# Altium project XC7Z010_Test_Bd_(Rev.A).PrjPcb
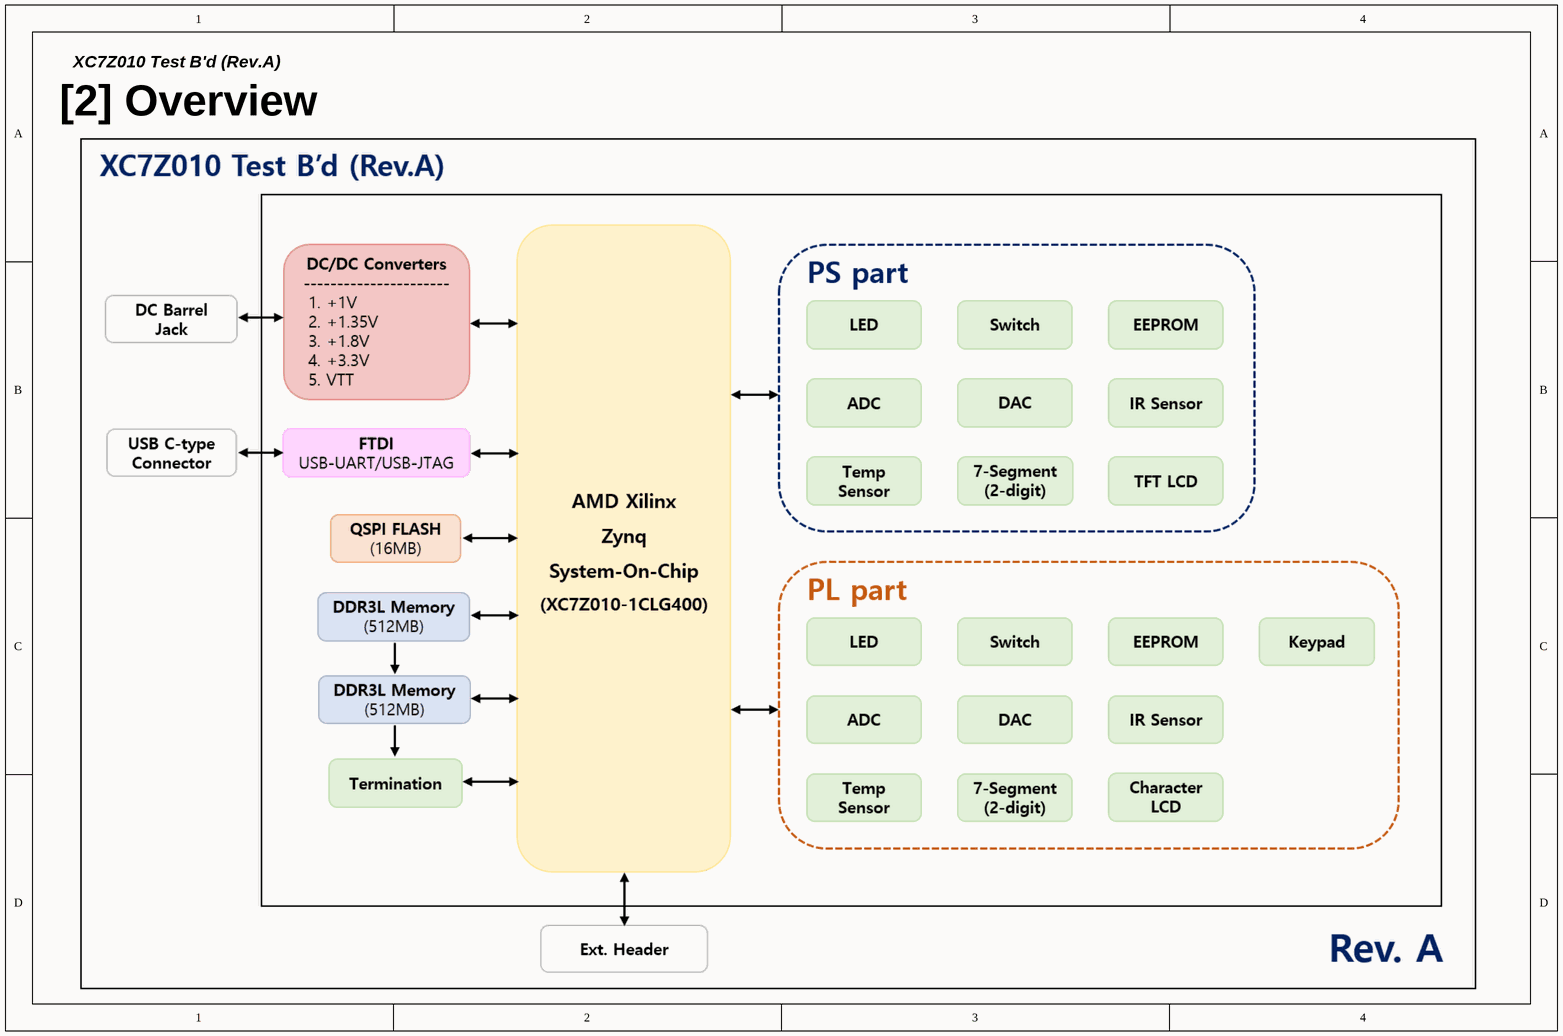
[diagram p0: 01_Overview.SchDoc]
10 sheets, 237 parts. Net scope: global (net labels, ports and power ports of the same name join across sheets).
Sheets:
  01_Overview.SchDoc
  02_Power_Budget.SchDoc
  03_Power.SchDoc
  04_Zynq_Power.SchDoc
  05_Zynq_Config.SchDoc
  06_Zynq_PS.SchDoc
  Ref.00_Zynq_Power_Config_1.SchDoc
  Ref.01_Zynq_Power_Config_2.SchDoc
  Ref.02_DDR_Memory_1.SchDoc
  Ref.03_DDR_Memory_2.SchDoc

## Sheet 01_Overview.SchDoc
size A4; SheetNumber: 2; SheetTotal: 6

### Notes on the sheet
- XC7Z010 Test B'd (Rev.A)
- [2] Overview

## Sheet 02_Power_Budget.SchDoc
size A4; SheetNumber: 3; SheetTotal: 6
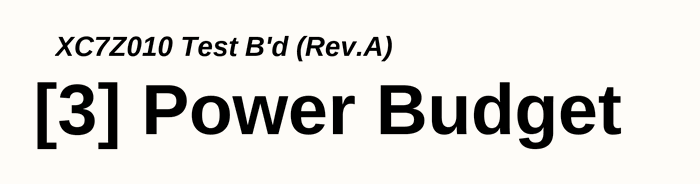
[diagram p1: 02_Power_Budget.SchDoc]

### Notes on the sheet
- XC7Z010 Test B'd (Rev.A)
- [3] Power Budget

## Sheet 03_Power.SchDoc
size A3; SheetNumber: 4; SheetTotal: 7
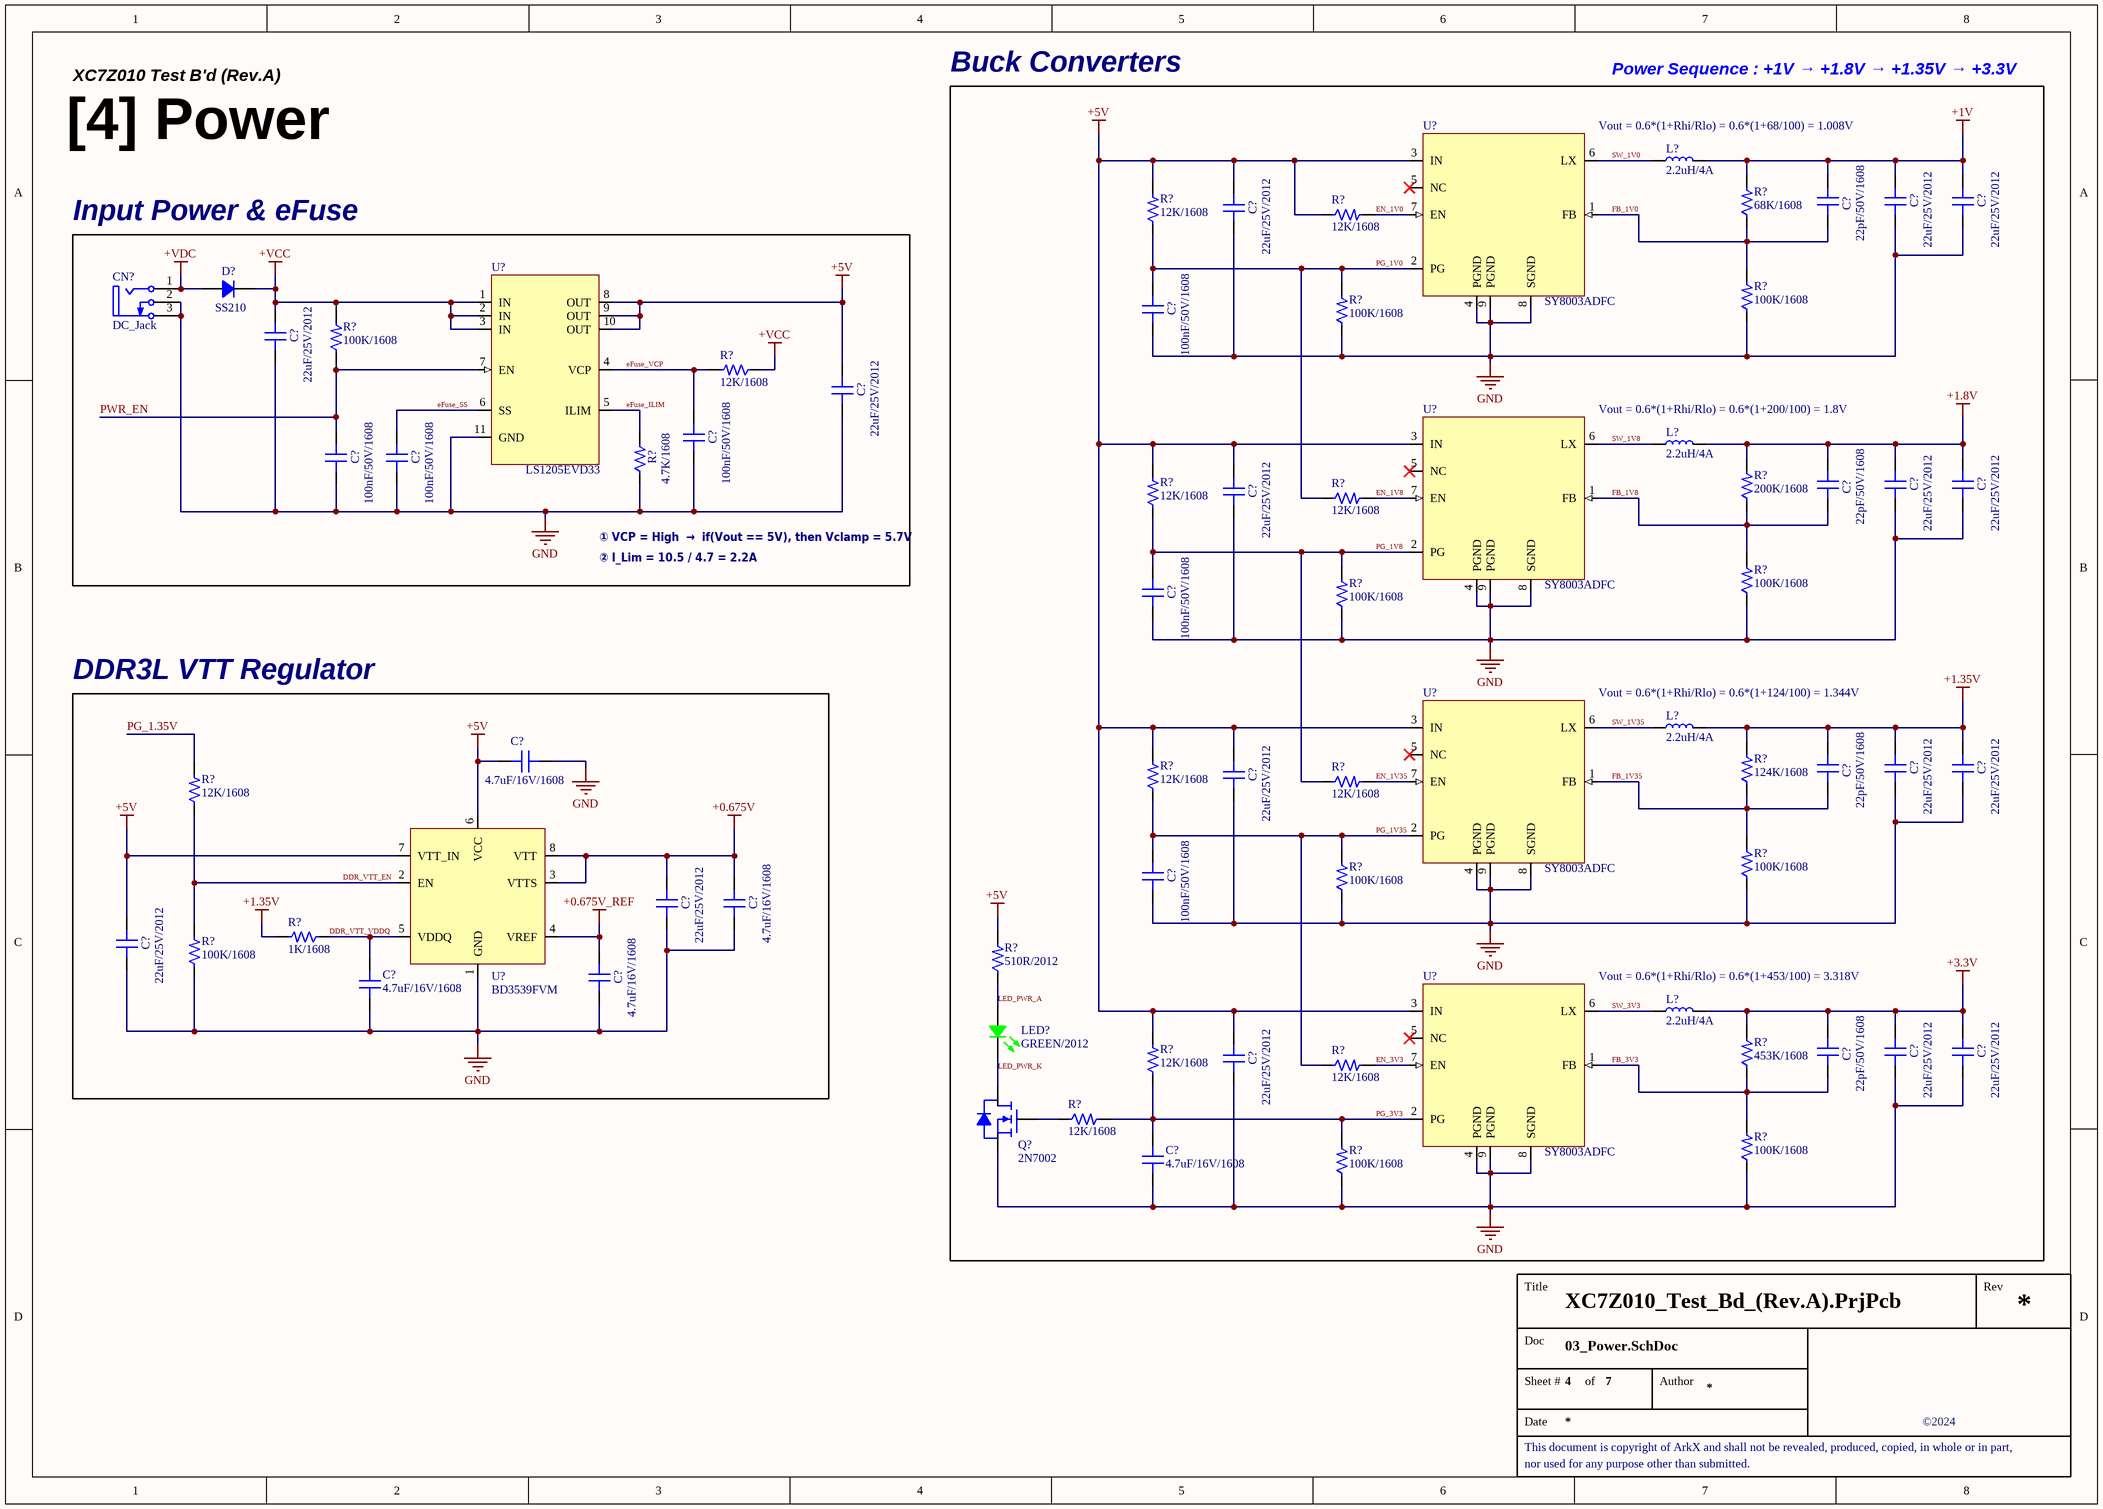
[diagram p2: 03_Power.SchDoc]

### Parts
(Parts that share a designator on the sheet are numbered #1, #2 ... from top to bottom, then left to right.)
C?#1  22pF/50V/1608  [CAP 1608 (0603_INCH)]
C?#2  22uF/25V/2012  [CAP 2012 (0805_INCH)]
C?#3  22uF/25V/2012  [CAP 2012 (0805_INCH)]
C?#4  22uF/25V/2012  [CAP 2012 (0805_INCH)]
C?#5  100nF/50V/1608  [CAP 1608 (0603_INCH)]
C?#6  22uF/25V/2012  [CAP 2012 (0805_INCH)]
C?#7  22uF/25V/2012  [CAP 2012 (0805_INCH)]
C?#8  100nF/50V/1608  [CAP 1608 (0603_INCH)]
C?#9  100nF/50V/1608  [CAP 1608 (0603_INCH)]
C?#10  100nF/50V/1608  [CAP 1608 (0603_INCH)]
C?#11  22pF/50V/1608  [CAP 1608 (0603_INCH)]
C?#12  22uF/25V/2012  [CAP 2012 (0805_INCH)]
C?#13  22uF/25V/2012  [CAP 2012 (0805_INCH)]
C?#14  22uF/25V/2012  [CAP 2012 (0805_INCH)]
C?#15  100nF/50V/1608  [CAP 1608 (0603_INCH)]
C?#16  4.7uF/16V/1608  [CAP 1608 (0603_INCH)]
C?#17  22pF/50V/1608  [CAP 1608 (0603_INCH)]
C?#18  22uF/25V/2012  [CAP 2012 (0805_INCH)]
C?#19  22uF/25V/2012  [CAP 2012 (0805_INCH)]
C?#20  22uF/25V/2012  [CAP 2012 (0805_INCH)]
C?#21  100nF/50V/1608  [CAP 1608 (0603_INCH)]
C?#22  22uF/25V/2012  [CAP 2012 (0805_INCH)]
C?#23  4.7uF/16V/1608  [CAP 1608 (0603_INCH)]
C?#24  22uF/25V/2012  [CAP 2012 (0805_INCH)]
C?#25  4.7uF/16V/1608  [CAP 1608 (0603_INCH)]
C?#26  4.7uF/16V/1608  [CAP 1608 (0603_INCH)]
C?#27  22pF/50V/1608  [CAP 1608 (0603_INCH)]
C?#28  22uF/25V/2012  [CAP 2012 (0805_INCH)]
C?#29  22uF/25V/2012  [CAP 2012 (0805_INCH)]
C?#30  22uF/25V/2012  [CAP 2012 (0805_INCH)]
C?#31  4.7uF/16V/1608  [CAP 1608 (0603_INCH)]
CN?#1  DC_Jack  [CON DC-Jack]
D?#1  SS210  [DIO DO-214AC (SMA)]
L?#1  2.2uH/4A  [IND BWVS006060282R2M00]
L?#2  2.2uH/4A  [IND BWVS006060282R2M00]
L?#3  2.2uH/4A  [IND BWVS006060282R2M00]
L?#4  2.2uH/4A  [IND BWVS006060282R2M00]
LED?#1  GREEN/2012  [LED MHT170RGBCT (GREEN)]
Q?#1  2N7002  [SOT 23-3 (DIODES INCORPORATED)]
R?#1  68K/1608  [RES 1608 (0603_inch)]
R?#2  12K/1608  [RES 1608 (0603_inch)]
R?#3  12K/1608  [RES 1608 (0603_inch)]
R?#4  100K/1608  [RES 1608 (0603_inch)]
R?#5  100K/1608  [RES 1608 (0603_inch)]
R?#6  100K/1608  [RES 1608 (0603_inch)]
R?#7  12K/1608  [RES 1608 (0603_inch)]
R?#8  4.7K/1608  [RES 1608 (0603_inch)]
R?#9  200K/1608  [RES 1608 (0603_inch)]
R?#10  12K/1608  [RES 1608 (0603_inch)]
R?#11  12K/1608  [RES 1608 (0603_inch)]
R?#12  100K/1608  [RES 1608 (0603_inch)]
R?#13  100K/1608  [RES 1608 (0603_inch)]
R?#14  124K/1608  [RES 1608 (0603_inch)]
R?#15  12K/1608  [RES 1608 (0603_inch)]
R?#16  12K/1608  [RES 1608 (0603_inch)]
R?#17  12K/1608  [RES 1608 (0603_inch)]
R?#18  100K/1608  [RES 1608 (0603_inch)]
R?#19  100K/1608  [RES 1608 (0603_inch)]
R?#20  1K/1608  [RES 1608 (0603_inch)]
R?#21  100K/1608  [RES 1608 (0603_inch)]
R?#22  510R/2012  [RES 2012 (0805_inch)]
R?#23  453K/1608  [RES 1608 (0603_inch)]
R?#24  12K/1608  [RES 1608 (0603_inch)]
R?#25  12K/1608  [RES 1608 (0603_inch)]
R?#26  12K/1608  [RES 1608 (0603_inch)]
R?#27  100K/1608  [RES 1608 (0603_inch)]
R?#28  100K/1608  [RES 1608 (0603_inch)]
U?#1  SY8003ADFC  [DFN2x2-8]
U?#2  LS1205EVD33
U?#3  SY8003ADFC  [DFN2x2-8]
U?#4  SY8003ADFC  [DFN2x2-8]
U?#5  BD3539FVM
U?#6  SY8003ADFC  [DFN2x2-8]

### Blocks framed on the sheet
Buck Converters: C?#1-C?#5 C?#11-C?#15 C?#17-C?#21 C?#27-C?#31 L?#1-L?#4 LED?#1 Q?#1 R?#1-R?#5 R?#9-R?#16 R?#18 R?#19 R?#22-R?#28 U?#1 U?#3 U?#4 U?#6
Input Power & eFuse: C?#6-C?#10 CN?#1 D?#1 R?#6-R?#8 U?#2
DDR3L VTT Regulator: C?#16 C?#22-C?#26 R?#17 R?#20 R?#21 U?#5

### Nets
+0.675V: C?#22.2 C?#23.2 U?#5.3(VTTS) U?#5.8(VTT)
+0.675V_REF: C?#25.2 U?#5.4(VREF)
+1.8V: C?#11.2 C?#12.2 C?#13.2 L?#2.2 R?#9.2
+1.35V: C?#17.2 C?#18.2 C?#19.2 L?#3.2 R?#14.2 R?#20.2
+1V: C?#1.2 C?#2.2 C?#3.2 L?#1.2 R?#1.2
+3.3V: C?#27.2 C?#28.2 C?#29.2 L?#4.2 R?#23.2
+5V: C?#4.2 C?#7.2 C?#14.2 C?#16.2 C?#20.2 C?#24.2 C?#30.2 R?#2.2 R?#3.1 R?#10.2 R?#15.2 R?#22.2 R?#24.2 U?#1.3(IN) U?#2.8(OUT) U?#2.9(OUT) U?#2.10(OUT) U?#3.3(IN) U?#4.3(IN) U?#5.6(VCC) U?#5.7(VTT_IN) U?#6.3(IN)
+VCC: C?#6.2 D?#1.2 R?#6.2 R?#7.1 U?#2.1(IN) U?#2.2(IN) U?#2.3(IN)
+VDC: CN?#1.1(VCC) D?#1.1
GND: C?#2.1 C?#3.1 C?#4.1 C?#5.1 C?#6.1 C?#7.1 C?#8.1 C?#9.1 C?#10.1 C?#12.1 C?#13.1 C?#14.1 C?#15.1 C?#16.1 C?#18.1 C?#19.1 C?#20.1 C?#21.1 C?#22.1 C?#23.1 C?#24.1 C?#25.1 C?#26.1 C?#28.1 C?#29.1 C?#30.1 C?#31.1 CN?#1.2(GND) CN?#1.3(GND) Q?#1.2(S) R?#4.1 R?#5.1 R?#8.1 R?#12.1 R?#13.1 R?#18.1 R?#19.1 R?#21.1 R?#27.1 R?#28.1 U?#1.4(PGND) U?#1.8(SGND) U?#1.9(PGND) U?#2.11(GND) U?#3.4(PGND) U?#3.8(SGND) U?#3.9(PGND) U?#4.4(PGND) U?#4.8(SGND) U?#4.9(PGND) U?#5.1(GND) U?#6.4(PGND) U?#6.8(SGND) U?#6.9(PGND)
DDR_VTT_EN: R?#17.1 R?#21.2 U?#5.2(EN)
DDR_VTT_VDDQ: C?#26.2 R?#20.1 U?#5.5(VDDQ)
eFuse_ILIM: R?#8.2 U?#2.5(ILIM)
eFuse_SS: C?#10.2 U?#2.6(SS)
eFuse_VCP: C?#8.2 R?#7.2 U?#2.4(VCP)
EN_1V0: R?#3.2 U?#1.7(EN)
EN_1V8: R?#11.2 U?#3.7(EN)
EN_1V35: R?#16.2 U?#4.7(EN)
EN_3V3: R?#25.2 U?#6.7(EN)
FB_1V0: C?#1.1 R?#1.1 R?#4.2 U?#1.1(FB)
FB_1V8: C?#11.1 R?#9.1 R?#12.2 U?#3.1(FB)
FB_1V35: C?#17.1 R?#14.1 R?#18.2 U?#4.1(FB)
FB_3V3: C?#27.1 R?#23.1 R?#27.2 U?#6.1(FB)
LED_PWR_A: LED?#1.4(Common_Anode) R?#22.1
LED_PWR_K: LED?#1.2(GREEN) Q?#1.3(D)
PG_1.35V: R?#17.2
PG_1V0: C?#5.2 R?#2.1 R?#5.2 R?#11.1 U?#1.2(PG)
PG_1V8: C?#15.2 R?#10.1 R?#13.2 R?#16.1 U?#3.2(PG)
PG_1V35: C?#21.2 R?#15.1 R?#19.2 R?#25.1 U?#4.2(PG)
PG_3V3: C?#31.2 R?#24.1 R?#26.2 R?#28.2 U?#6.2(PG)
PWR_EN: C?#9.2 R?#6.1 U?#2.7(EN)
SW_1V0: L?#1.1 U?#1.6(LX)
SW_1V8: L?#2.1 U?#3.6(LX)
SW_1V35: L?#3.1 U?#4.6(LX)
SW_3V3: L?#4.1 U?#6.6(LX)
NetQ?#1_1: Q?#1.1(G) R?#26.1

Not connected (* = marked no-connect by the designer): U?#1 5(NC)*; U?#3 5(NC)*; U?#4 5(NC)*; U?#6 5(NC)*

### Notes on the sheet
- XC7Z010 Test B'd (Rev.A)
- Power Sequence : +1V → +1.8V → +1.35V → +3.3V
- [4] Power
- Vout = 0.6*(1+Rhi/Rlo) = 0.6*(1+68/100) = 1.008V
- Vout = 0.6*(1+Rhi/Rlo) = 0.6*(1+200/100) = 1.8V
- ① VCP = High  →  if(Vout == 5V), then Vclamp = 5.7V
- ② I_Lim = 10.5 / 4.7 = 2.2A
- Vout = 0.6*(1+Rhi/Rlo) = 0.6*(1+124/100) = 1.344V
- Vout = 0.6*(1+Rhi/Rlo) = 0.6*(1+453/100) = 3.318V
- Title
- Rev
- Doc
- Sheet #
- of
- Author
- This document is copyright of ArkX and shall not be revealed, produced, copied, in whole or in part,
- Date
- ©2024
- nor used for any purpose other than submitted.

### Library data of the parts
C?#1 C?#11 C?#17 C?#27 = CAP_22pF/50V/1608: Ceramic CAP_22pF/50V/1608; LCSC Part #: C1653; JLCPCB Part Type: Basic Part
C?#2-C?#4 C?#6 C?#7 C?#12-C?#14 C?#18-C?#20 C?#22 C?#24 C?#28-C?#30 = CAP_22uF/25V/2012: Ceramic CAP_22uF/25V/2012; LCSC Part #: C45783; JLCPCB Part Type: Basic Part
C?#5 C?#8-C?#10 C?#15 C?#21 = CAP_100nF/50V/1608: Ceramic CAP_100nF/50V/1608; LCSC Part #: C14663; JLCPCB Part Type: Basic Part
C?#16 C?#23 C?#25 C?#26 C?#31 = CAP_4.7uF/16V/1608: Ceramic CAP_4.7uF/16V/1608; LCSC Part #: C19666; JLCPCB Part Type: Basic Part
CN?#1 = CON_DC-Jack: ComponentLink1Description: Manufacturer Link; ComponentLink1URL: http://www.cliffuk.co.uk/
D?#1 = DIO_SS210: 100V 850mV@2A 2A SMA(DO-214AC)  Schottky Barrier Diodes (SBD) ROHS; LCSC Part #: C14996; JLCPCB Part Type: Basic Part
L?#1-L?#4 = IND_BWVS006060282R2M00: FIXED IND 2.2uH 4A 20mohm SMD; Supplier 1: Digi-Key; Supplier 2: Mouser
LED?#1 = LED_MHT170RGBCT(GREEN): Colorless transparence -30℃~+85℃ Positive post Common anode RGB 120° 0805  Light Emitting Diodes (LED) ROHS; LCSC Part #: C2962094; JLCPCB Part Type: Extended Part
Q?#1 = FET_2N7002: 60V 115mA 200mW 7.5Ω@10V,500mA N Channel SOT-23  MOSFETs ROHS; LCSC Part #: C8545; JLCPCB Part Type: Basic Part
R?#1 = RES_68K/1608/0.1W: Value: 68K; Power Rating: 0.1W; Precision: 1%; Size: 1608; LCSC Part #: C23231; JLCPCB Part Type: Basic Part
R?#2 R?#3 R?#7 R?#10 R?#11 R?#15-R?#17 R?#24-R?#26 = RES_12K/1608/0.1W: Value: 12K; Power Rating: 0.1W; Precision: 1%; Size: 1608; LCSC Part #: C22790; JLCPCB Part Type: Basic Part
R?#4-R?#6 R?#12 R?#13 R?#18 R?#19 R?#21 R?#27 R?#28 = RES_100K/1608/0.1W: Value: 100K; Power Rating: 0.1W; Precision: 1%; Size: 1608; LCSC Part #: C25803; JLCPCB Part Type: Basic Part
R?#8 = RES_4.7K/1608/0.1W: Value: 4.7K; Power Rating: 0.1W; Precision: 1%; Size: 1608; LCSC Part #: C23162; JLCPCB Part Type: Basic Part
R?#9 = RES_200K/1608/0.1W: Value: 200K; Power Rating: 0.1W; Precision: 1%; Size: 1608; LCSC Part #: C25811; JLCPCB Part Type: Basic Part
R?#14 = RES_124K/1608/0.1W: Value: 124K; Power Rating: 0.1W; Precision: 1%; Size: 1608; LCSC Part #: C140118; JLCPCB Part Type: Extended Part
R?#20 = RES_1K/1608/0.1W: Value: 1K; Power Rating: 0.1W; Precision: 1%; Size: 1608; LCSC Part #: C21190; JLCPCB Part Type: Basic Part
R?#22 = RES_510R/2012/0.125W: Value: 510R; Power Rating: 0.125W; Precision: 1%; Size: 2012; LCSC Part #: C17734; JLCPCB Part Type: Basic Part
R?#23 = RES_453K/1608/0.1W: Value: 453K; Power Rating: 0.1W; Precision: 1%; Size: 1608; LCSC Part #: C25818; JLCPCB Part Type: Extended Part
U?#1 U?#3 U?#4 U?#6 = IC_REG_SY8003ADFC: High Efficiency 5.5V, 3A Continuous, 1MHz Synchronous Step Down Regulator; Manufacturer: Silergy; Manufacturer Part Number: High Efficiency 5.5V, 3A continuous, 1MHz; LCSC: C178236
U?#2 = IC_eFUSE_LS1205EVD33: 18V, 5A eFuse with Programmable Current Limit and Output Voltage Clamp, 10-DFN (3x3)
U?#5 = IC_REG_VTT_BD3539FVM: 1.0V to 5.5V, 1A 1ch / Termination Regulators for DDR-SDRAMs, 8-MSOP

## Sheet 04_Zynq_Power.SchDoc
size A2; SheetNumber: 5; SheetTotal: 7
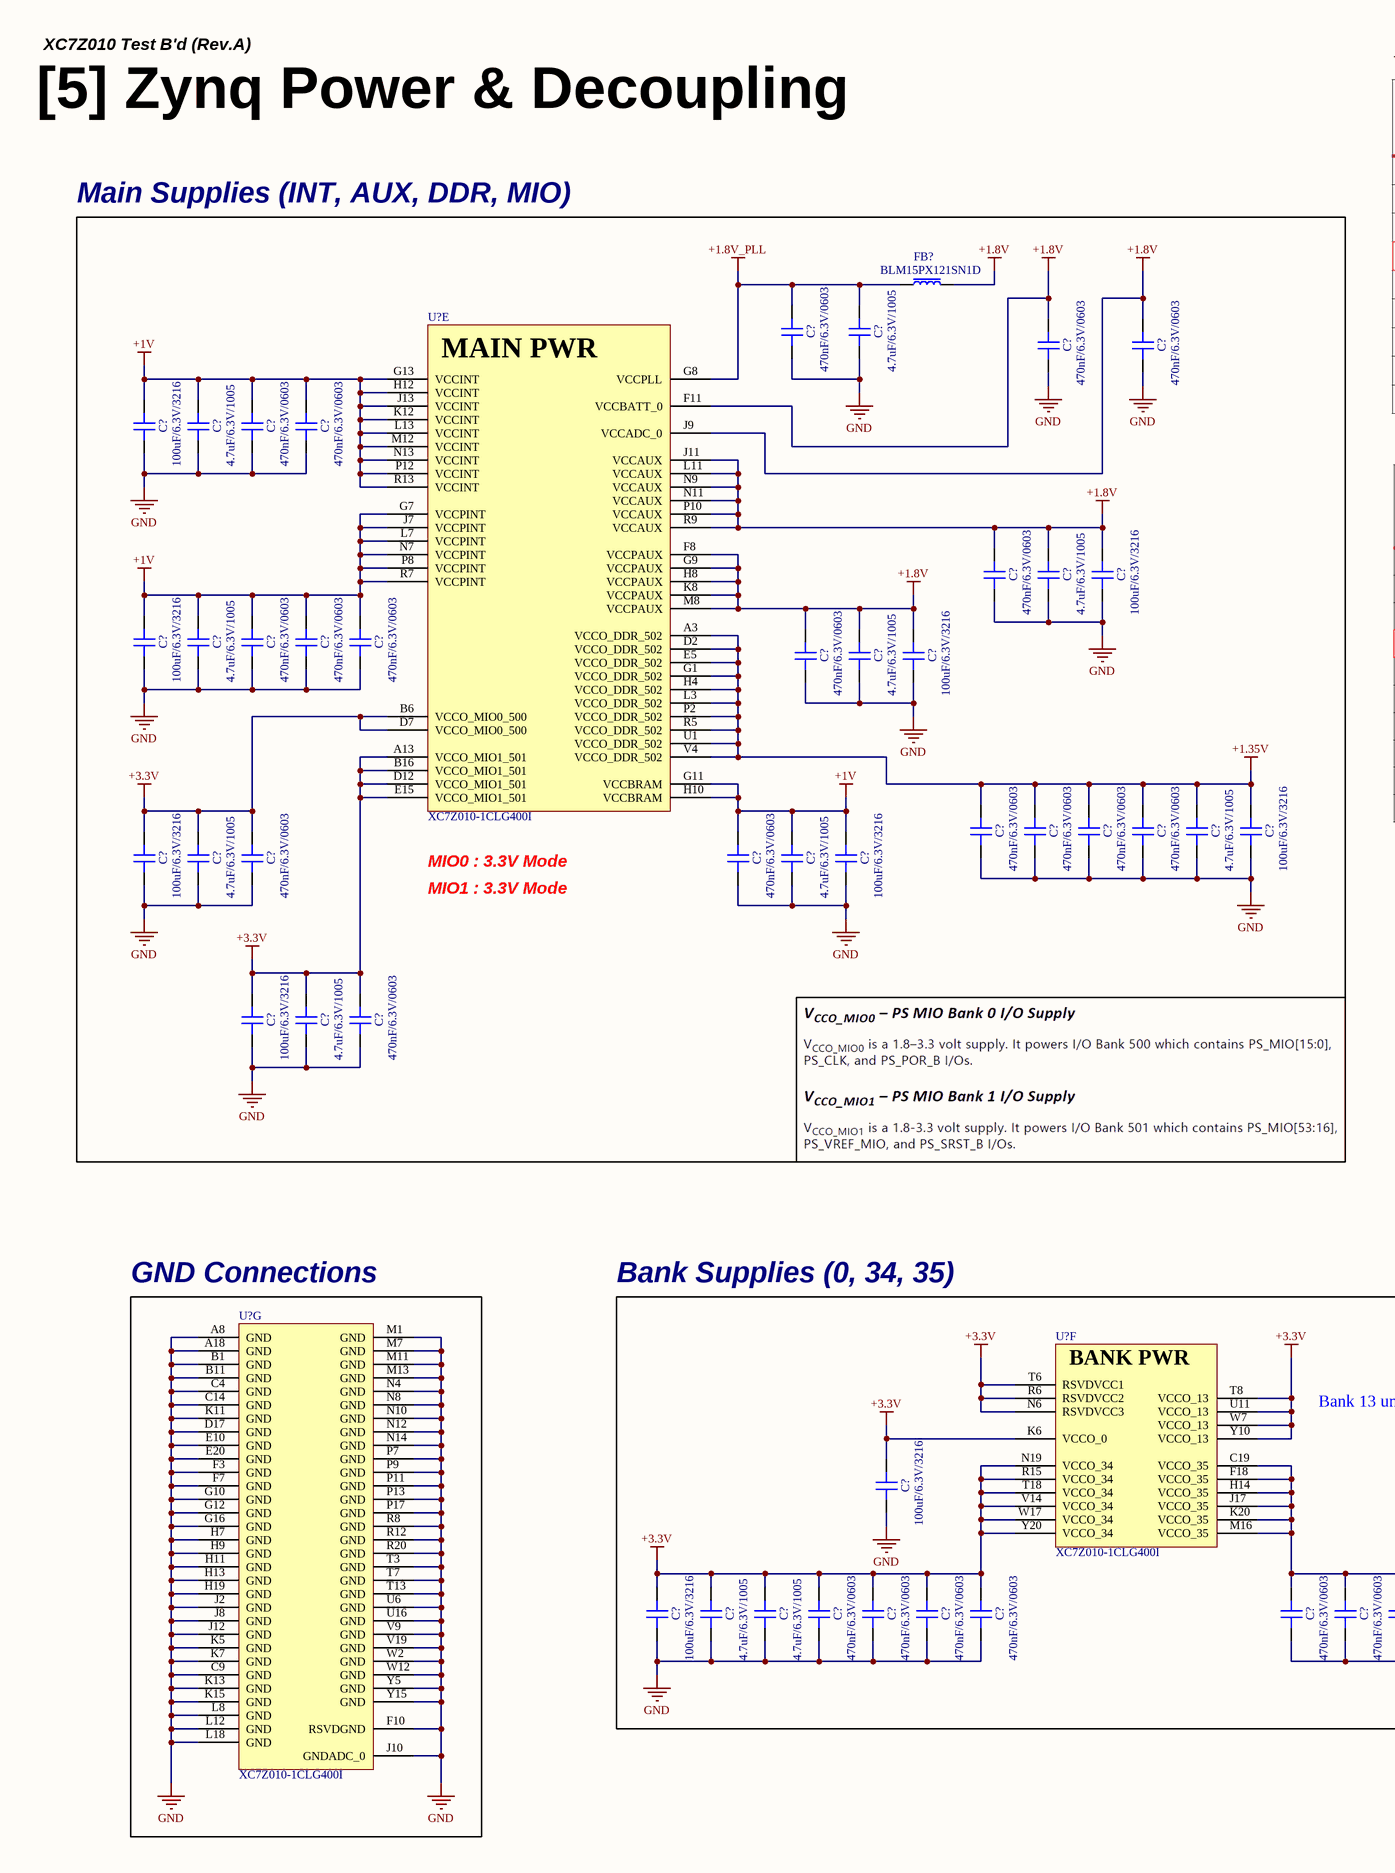
[diagram p3: 04_Zynq_Power.SchDoc, left]
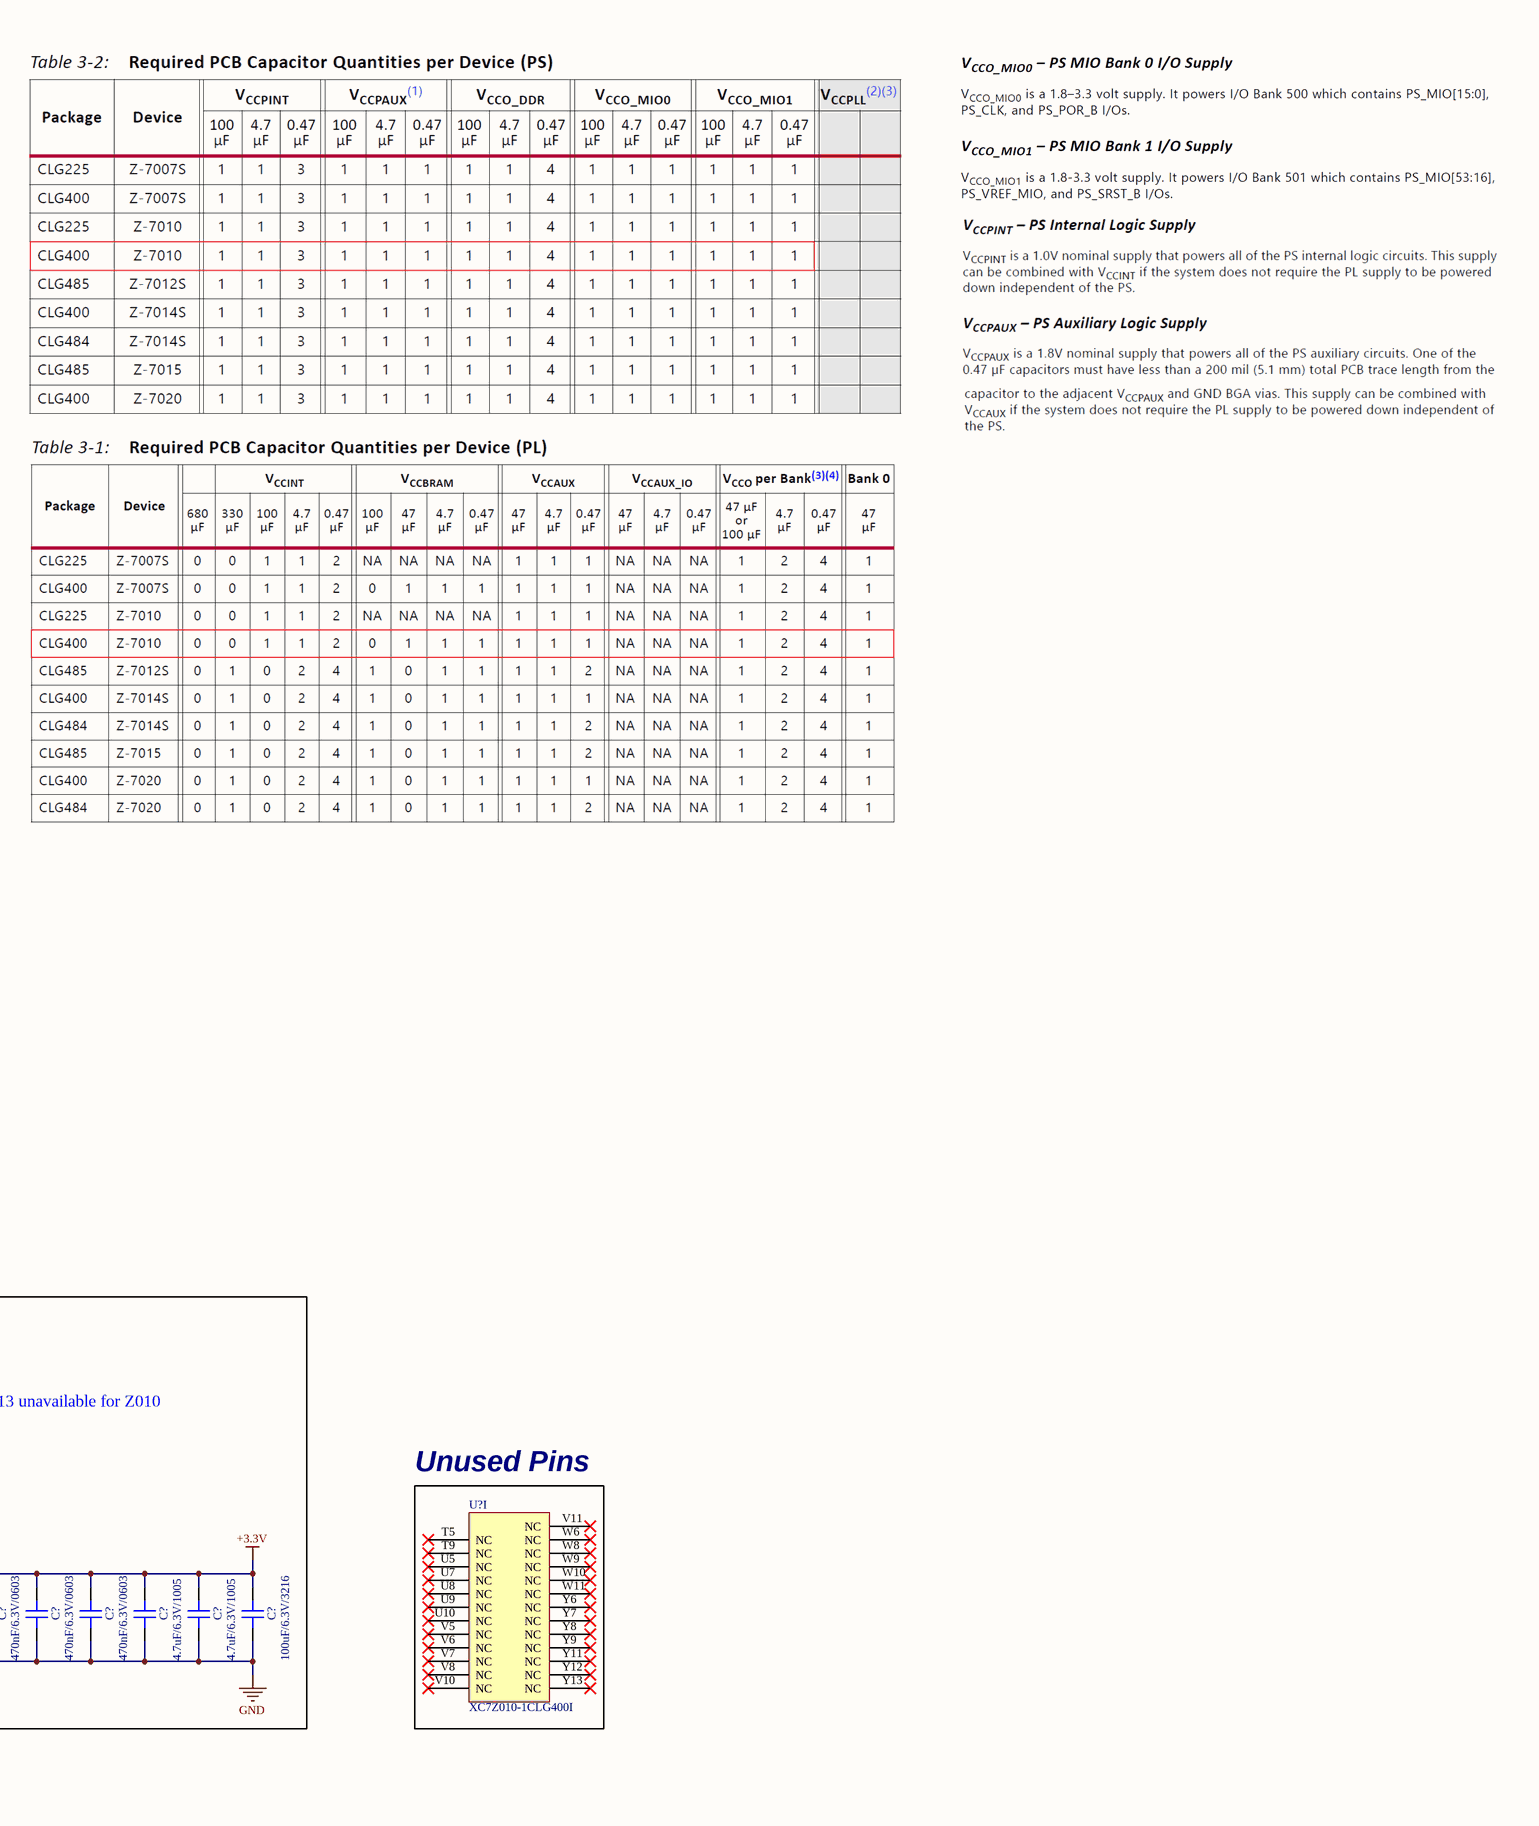
[diagram p4: 04_Zynq_Power.SchDoc, right]

### Parts
(Parts that share a designator on the sheet are numbered #1, #2 ... from top to bottom, then left to right.)
C?#32  470nF/6.3V/0603  [CAP 0603 (0201_INCH)]
C?#33  4.7uF/6.3V/1005  [CAP 1005 (0402_INCH)]
C?#34  470nF/6.3V/0603  [CAP 0603 (0201_INCH)]
C?#35  470nF/6.3V/0603  [CAP 0603 (0201_INCH)]
C?#36  100uF/6.3V/3216  [CAP 3216 (1206_INCH) - H1.8MM]
C?#37  4.7uF/6.3V/1005  [CAP 1005 (0402_INCH)]
C?#38  470nF/6.3V/0603  [CAP 0603 (0201_INCH)]
C?#39  470nF/6.3V/0603  [CAP 0603 (0201_INCH)]
C?#40  470nF/6.3V/0603  [CAP 0603 (0201_INCH)]
C?#41  4.7uF/6.3V/1005  [CAP 1005 (0402_INCH)]
C?#42  100uF/6.3V/3216  [CAP 3216 (1206_INCH) - H1.8MM]
C?#43  100uF/6.3V/3216  [CAP 3216 (1206_INCH) - H1.8MM]
C?#44  4.7uF/6.3V/1005  [CAP 1005 (0402_INCH)]
C?#45  470nF/6.3V/0603  [CAP 0603 (0201_INCH)]
C?#46  470nF/6.3V/0603  [CAP 0603 (0201_INCH)]
C?#47  470nF/6.3V/0603  [CAP 0603 (0201_INCH)]
C?#48  470nF/6.3V/0603  [CAP 0603 (0201_INCH)]
C?#49  4.7uF/6.3V/1005  [CAP 1005 (0402_INCH)]
C?#50  100uF/6.3V/3216  [CAP 3216 (1206_INCH) - H1.8MM]
C?#51  470nF/6.3V/0603  [CAP 0603 (0201_INCH)]
C?#52  470nF/6.3V/0603  [CAP 0603 (0201_INCH)]
C?#53  470nF/6.3V/0603  [CAP 0603 (0201_INCH)]
C?#54  470nF/6.3V/0603  [CAP 0603 (0201_INCH)]
C?#55  4.7uF/6.3V/1005  [CAP 1005 (0402_INCH)]
C?#56  100uF/6.3V/3216  [CAP 3216 (1206_INCH) - H1.8MM]
C?#57  100uF/6.3V/3216  [CAP 3216 (1206_INCH) - H1.8MM]
C?#58  4.7uF/6.3V/1005  [CAP 1005 (0402_INCH)]
C?#59  470nF/6.3V/0603  [CAP 0603 (0201_INCH)]
C?#60  470nF/6.3V/0603  [CAP 0603 (0201_INCH)]
C?#61  4.7uF/6.3V/1005  [CAP 1005 (0402_INCH)]
C?#62  100uF/6.3V/3216  [CAP 3216 (1206_INCH) - H1.8MM]
C?#63  100uF/6.3V/3216  [CAP 3216 (1206_INCH) - H1.8MM]
C?#64  4.7uF/6.3V/1005  [CAP 1005 (0402_INCH)]
C?#65  470nF/6.3V/0603  [CAP 0603 (0201_INCH)]
C?#66  100uF/6.3V/3216  [CAP 3216 (1206_INCH) - H1.8MM]
C?#67  100uF/6.3V/3216  [CAP 3216 (1206_INCH) - H1.8MM]
C?#68  4.7uF/6.3V/1005  [CAP 1005 (0402_INCH)]
C?#69  4.7uF/6.3V/1005  [CAP 1005 (0402_INCH)]
C?#70  470nF/6.3V/0603  [CAP 0603 (0201_INCH)]
C?#71  470nF/6.3V/0603  [CAP 0603 (0201_INCH)]
C?#72  470nF/6.3V/0603  [CAP 0603 (0201_INCH)]
C?#73  470nF/6.3V/0603  [CAP 0603 (0201_INCH)]
C?#74  470nF/6.3V/0603  [CAP 0603 (0201_INCH)]
C?#75  470nF/6.3V/0603  [CAP 0603 (0201_INCH)]
C?#76  470nF/6.3V/0603  [CAP 0603 (0201_INCH)]
C?#77  470nF/6.3V/0603  [CAP 0603 (0201_INCH)]
C?#78  4.7uF/6.3V/1005  [CAP 1005 (0402_INCH)]
C?#79  4.7uF/6.3V/1005  [CAP 1005 (0402_INCH)]
C?#80  100uF/6.3V/3216  [CAP 3216 (1206_INCH) - H1.8MM]
FB?#1  BLM15PX121SN1D  [FB 1005 (0402_inch)]
U?#7  XC7Z010-1CLG400I  (part E of 9)
U?#8  XC7Z010-1CLG400I  (part G of 9)
U?#9  XC7Z010-1CLG400I  (part F of 9)
U?#10  XC7Z010-1CLG400I  (part I of 9)

### Blocks framed on the sheet
Main Supplies (INT, AUX, DDR, MIO): C?#32-C?#65 FB?#1 U?#7
GND Connections: U?#8
Bank Supplies (0, 34, 35): C?#66-C?#80 U?#9
Unused Pins: U?#10

### Nets
+1.8V: C?#34.2 C?#35.2 C?#40.2 C?#41.2 C?#42.2 C?#48.2 C?#49.2 C?#50.2 FB?#1.2 U?#7.F8(VCCPAUX) U?#7.F11(VCCBATT_0) U?#7.G9(VCCPAUX) U?#7.H8(VCCPAUX) U?#7.J9(VCCADC_0) U?#7.J11(VCCAUX) U?#7.K8(VCCPAUX) U?#7.L11(VCCAUX) U?#7.M8(VCCPAUX) U?#7.N9(VCCAUX) U?#7.N11(VCCAUX) U?#7.P10(VCCAUX) U?#7.R9(VCCAUX)
+1.8V_PLL: C?#32.2 C?#33.2 FB?#1.1 U?#7.G8(VCCPLL)
+1.35V: C?#51.2 C?#52.2 C?#53.2 C?#54.2 C?#55.2 C?#56.2 U?#7.A3(VCCO_DDR_502) U?#7.D2(VCCO_DDR_502) U?#7.E5(VCCO_DDR_502) U?#7.G1(VCCO_DDR_502) U?#7.H4(VCCO_DDR_502) U?#7.L3(VCCO_DDR_502) U?#7.P2(VCCO_DDR_502) U?#7.R5(VCCO_DDR_502) U?#7.U1(VCCO_DDR_502) U?#7.V4(VCCO_DDR_502)
+1V: C?#36.2 C?#37.2 C?#38.2 C?#39.2 C?#43.2 C?#44.2 C?#45.2 C?#46.2 C?#47.2 C?#60.2 C?#61.2 C?#62.2 U?#7.G7(VCCPINT) U?#7.G11(VCCBRAM) U?#7.G13(VCCINT) U?#7.H10(VCCBRAM) U?#7.H12(VCCINT) U?#7.J7(VCCPINT) U?#7.J13(VCCINT) U?#7.K12(VCCINT) U?#7.L7(VCCPINT) U?#7.L13(VCCINT) U?#7.M12(VCCINT) U?#7.N7(VCCPINT) U?#7.N13(VCCINT) U?#7.P8(VCCPINT) U?#7.P12(VCCINT) U?#7.R7(VCCPINT) U?#7.R13(VCCINT)
+3.3V: C?#57.2 C?#58.2 C?#59.2 C?#63.2 C?#64.2 C?#65.2 C?#66.2 C?#67.2 C?#68.2 C?#69.2 C?#70.2 C?#71.2 C?#72.2 C?#73.2 C?#74.2 C?#75.2 C?#76.2 C?#77.2 C?#78.2 C?#79.2 C?#80.2 U?#7.A13(VCCO_MIO1_501) U?#7.B6(VCCO_MIO0_500) U?#7.B16(VCCO_MIO1_501) U?#7.D7(VCCO_MIO0_500) U?#7.D12(VCCO_MIO1_501) U?#7.E15(VCCO_MIO1_501) U?#9.C19(VCCO_35) U?#9.F18(VCCO_35) U?#9.H14(VCCO_35) U?#9.J17(VCCO_35) U?#9.K6(VCCO_0) U?#9.K20(VCCO_35) U?#9.M16(VCCO_35) U?#9.N6(RSVDVCC3) U?#9.N19(VCCO_34) U?#9.R6(RSVDVCC2) U?#9.R15(VCCO_34) U?#9.T6(RSVDVCC1) U?#9.T8(VCCO_13) U?#9.T18(VCCO_34) U?#9.U11(VCCO_13) U?#9.V14(VCCO_34) U?#9.W7(VCCO_13) U?#9.W17(VCCO_34) U?#9.Y10(VCCO_13) U?#9.Y20(VCCO_34)
GND: C?#32.1 C?#33.1 C?#34.1 C?#35.1 C?#36.1 C?#37.1 C?#38.1 C?#39.1 C?#40.1 C?#41.1 C?#42.1 C?#43.1 C?#44.1 C?#45.1 C?#46.1 C?#47.1 C?#48.1 C?#49.1 C?#50.1 C?#51.1 C?#52.1 C?#53.1 C?#54.1 C?#55.1 C?#56.1 C?#57.1 C?#58.1 C?#59.1 C?#60.1 C?#61.1 C?#62.1 C?#63.1 C?#64.1 C?#65.1 C?#66.1 C?#67.1 C?#68.1 C?#69.1 C?#70.1 C?#71.1 C?#72.1 C?#73.1 C?#74.1 C?#75.1 C?#76.1 C?#77.1 C?#78.1 C?#79.1 C?#80.1 U?#8.A8(GND) U?#8.A18(GND) U?#8.B1(GND) U?#8.B11(GND) U?#8.C4(GND) U?#8.C9(GND) U?#8.C14(GND) U?#8.D17(GND) U?#8.E10(GND) U?#8.E20(GND) U?#8.F3(GND) U?#8.F7(GND) U?#8.F10(RSVDGND) U?#8.G10(GND) U?#8.G12(GND) U?#8.G16(GND) U?#8.H7(GND) U?#8.H9(GND) U?#8.H11(GND) U?#8.H13(GND) U?#8.H19(GND) U?#8.J2(GND) U?#8.J8(GND) U?#8.J10(GNDADC_0) U?#8.J12(GND) U?#8.K5(GND) U?#8.K7(GND) U?#8.K11(GND) U?#8.K13(GND) U?#8.K15(GND) U?#8.L8(GND) U?#8.L12(GND) U?#8.L18(GND) U?#8.M1(GND) U?#8.M7(GND) U?#8.M11(GND) U?#8.M13(GND) U?#8.N4(GND) U?#8.N8(GND) U?#8.N10(GND) U?#8.N12(GND) U?#8.N14(GND) U?#8.P7(GND) U?#8.P9(GND) U?#8.P11(GND) U?#8.P13(GND) U?#8.P17(GND) U?#8.R8(GND) U?#8.R12(GND) U?#8.R20(GND) U?#8.T3(GND) U?#8.T7(GND) U?#8.T13(GND) U?#8.U6(GND) U?#8.U16(GND) U?#8.V9(GND) U?#8.V19(GND) U?#8.W2(GND) U?#8.W12(GND) U?#8.Y5(GND) U?#8.Y15(GND)

Not connected (* = marked no-connect by the designer): U?#10 T5(NC)* T9(NC)* U5(NC)* U7(NC)* U8(NC)* U9(NC)* U10(NC)* V5(NC)* V6(NC)* V7(NC)* V8(NC)* V10(NC)* V11(NC)* W6(NC)* W8(NC)* W9(NC)* W10(NC)* W11(NC)* Y6(NC)* Y7(NC)* Y8(NC)* Y9(NC)* Y11(NC)* Y12(NC)* Y13(NC)*

### Notes on the sheet
- XC7Z010 Test B'd (Rev.A)
- [5] Zynq Power & Decoupling
- MIO0 : 3.3V Mode
- MIO1 : 3.3V Mode
- Bank 13 unavailable for Z010
- Title
- Rev
- Doc
- Sheet #
- of
- Author
- This document is copyright of ArkX and shall not be revealed, produced, copied, in whole or in part,
- Date
- nor used for any purpose other than submitted.
- (in symbol IC_SOC_XC7Z010-1CLG400I, part E) MAIN PWR
- (in symbol IC_SOC_XC7Z010-1CLG400I, part F) BANK PWR

### Library data of the parts
C?#32 C?#34 C?#35 C?#38-C?#40 C?#45-C?#48 C?#51-C?#54 C?#59 C?#60 C?#65 C?#70-C?#77 = CAP_470nF/6.3V/0603: Ceramic CAP_470nF/6.3V/0603; LCSC Part #: C2992535; JLCPCB Part Type: Extended Part
C?#33 C?#37 C?#41 C?#44 C?#49 C?#55 C?#58 C?#61 C?#64 C?#68 C?#69 C?#78 C?#79 = CAP_4.7uF/6.3V/1005: Ceramic CAP_4.7uF/6.3V/1005; LCSC Part #: C76995; JLCPCB Part Type: Extended Part
C?#36 C?#42 C?#43 C?#50 C?#56 C?#57 C?#62 C?#63 C?#66 C?#67 C?#80 = CAP_100uF/6.3V/3216: Ceramic CAP_100uF/6.3V/3216; LCSC Part #: C15008; JLCPCB Part Type: Basic Part
FB?#1 = FB_BLM15PX121SN1D: 55mΩ ±25% 120Ω@100MHz 0402  Ferrite Beads ROHS; LCSC Part #: C88970; JLCPCB Part Type: Extended Part
U?#7-U?#10 = IC_SOC_XC7Z010-1CLG400I: Dual ARM® Cortex®-A9 MPCore™ with CoreSight™ System On Chip (SOC) IC Zynq®-7000 Artix™-7 FPGA, 28K Logic Cells 766MHz 400-CSPBGA (17x17)

## Sheet 05_Zynq_Config.SchDoc
size A2; SheetNumber: 6; SheetTotal: 7
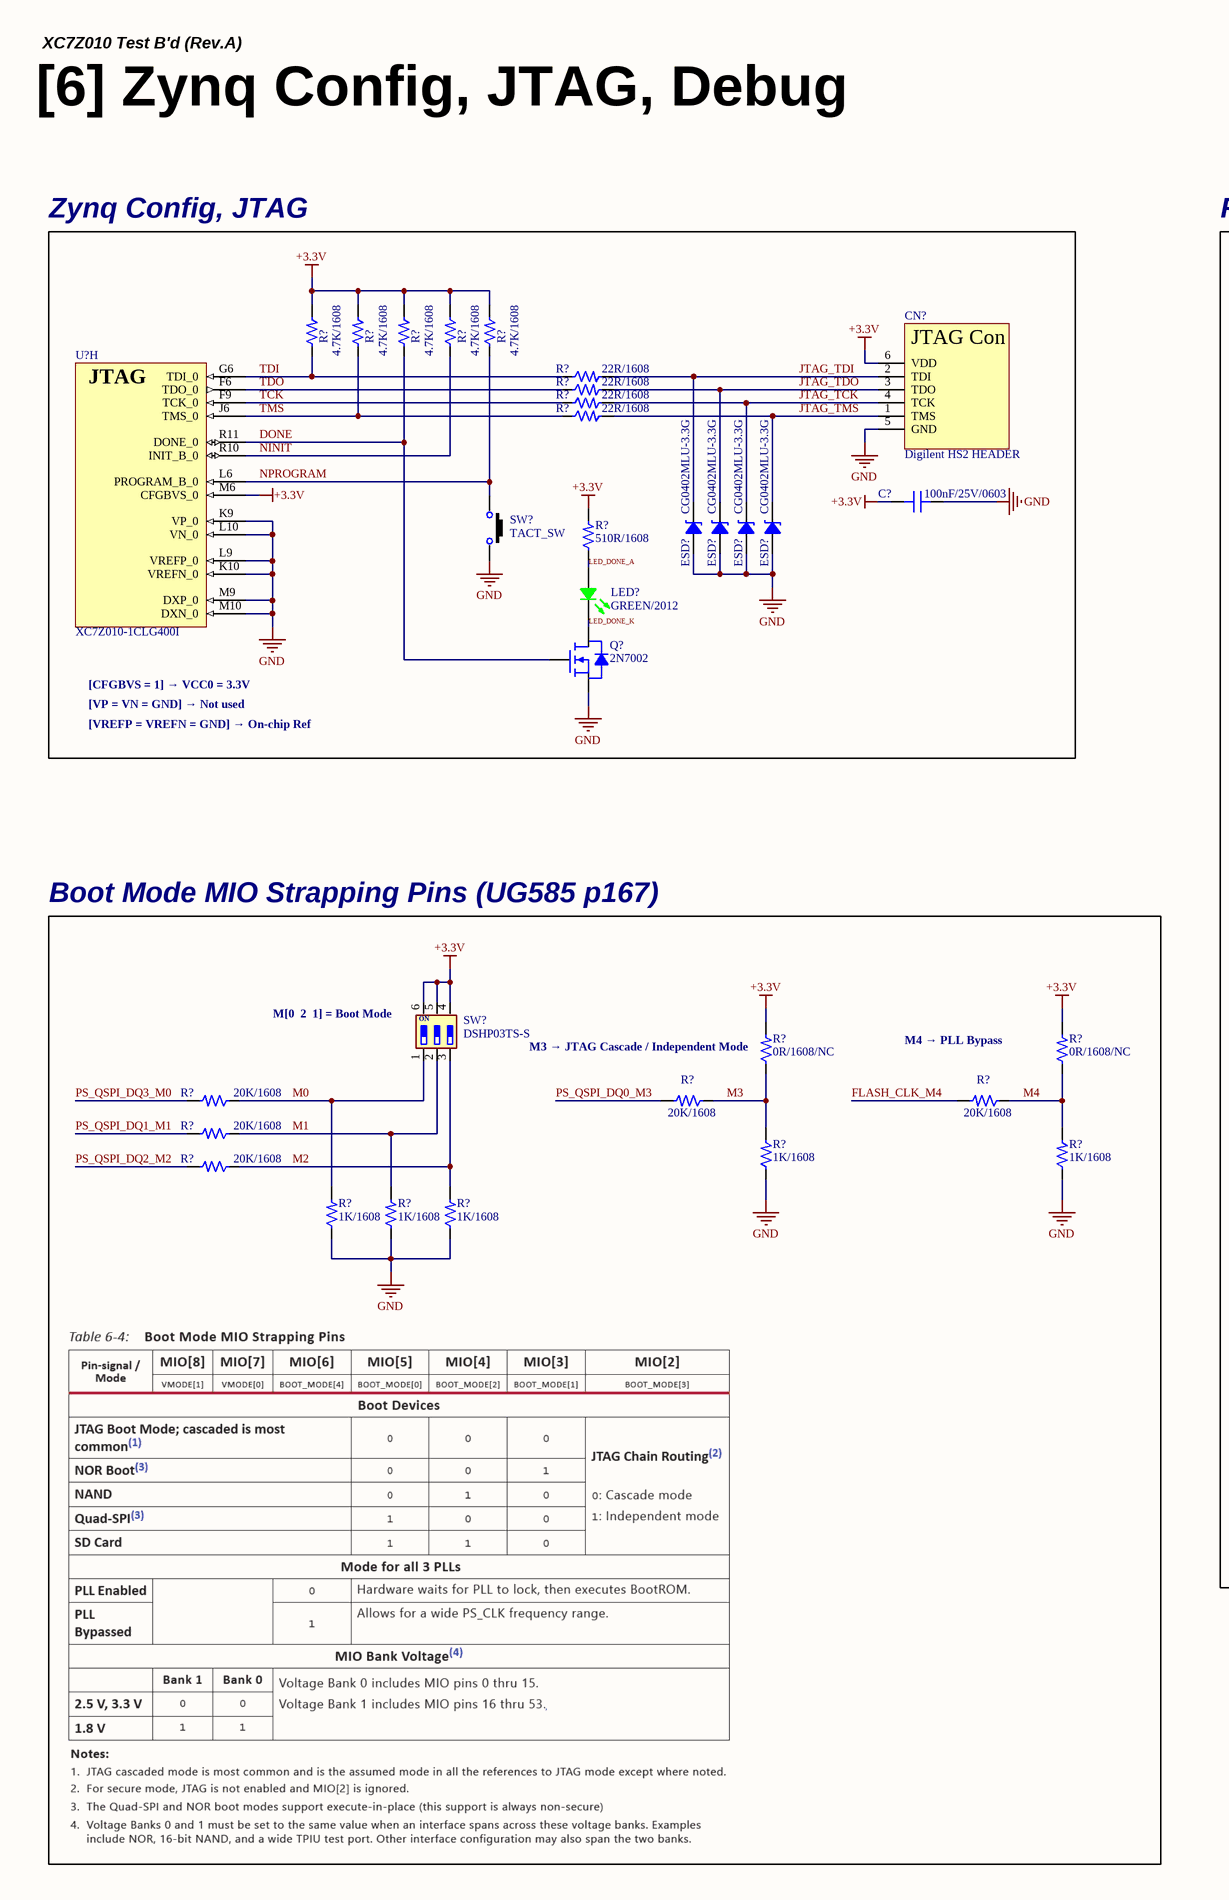
[diagram p5: 05_Zynq_Config.SchDoc, left]
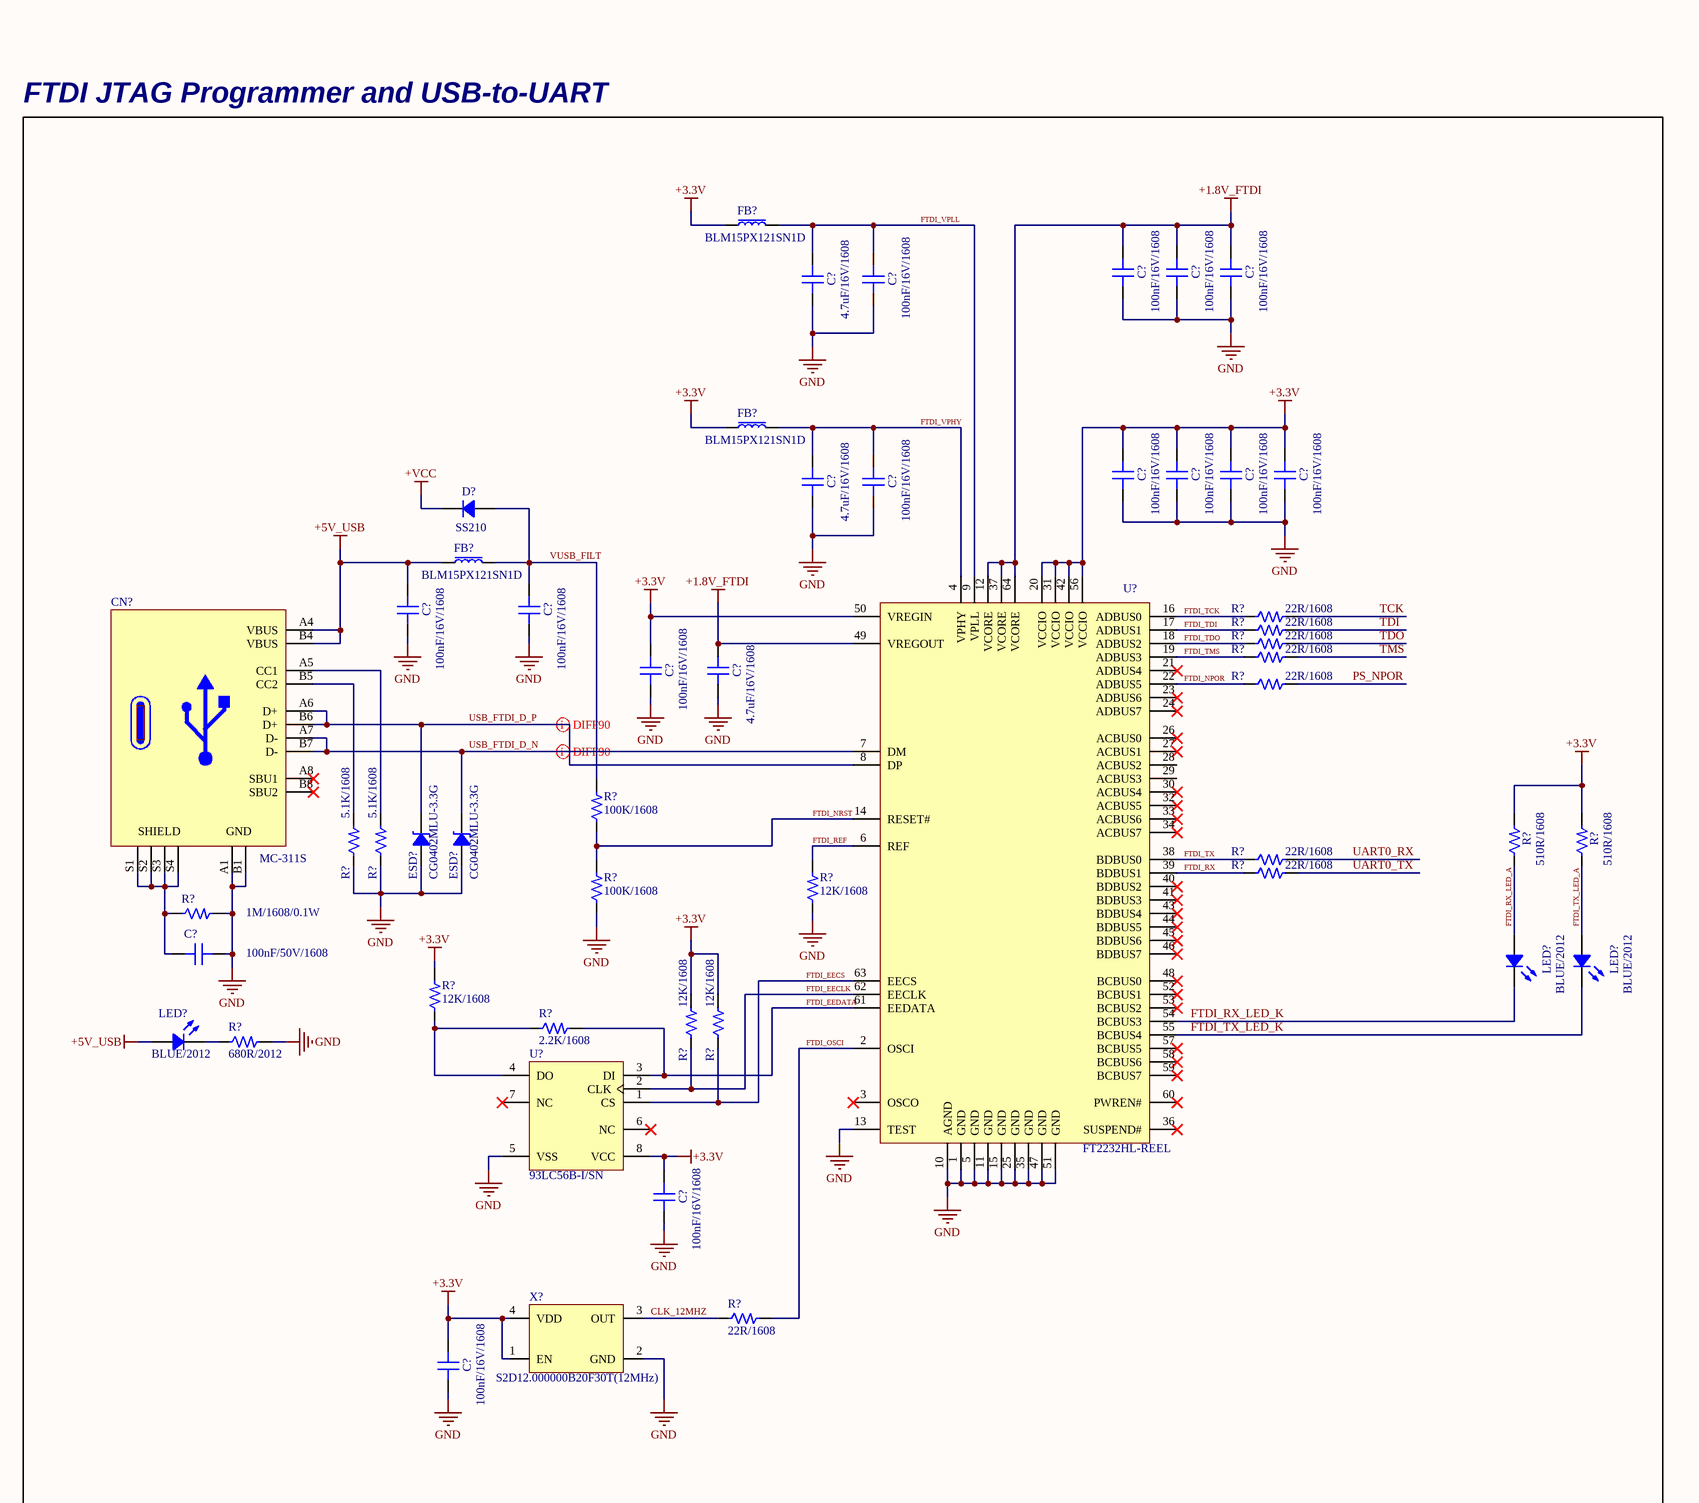
[diagram p6: 05_Zynq_Config.SchDoc, right]

### Parts
(Parts that share a designator on the sheet are numbered #1, #2 ... from top to bottom, then left to right.)
C?#81  100nF/16V/1608  [CAP 1608 (0603_INCH)]
C?#82  100nF/16V/1608  [CAP 1608 (0603_INCH)]
C?#83  100nF/16V/1608  [CAP 1608 (0603_INCH)]
C?#84  4.7uF/16V/1608  [CAP 1608 (0603_INCH)]
C?#85  100nF/16V/1608  [CAP 1608 (0603_INCH)]
C?#86  100nF/25V/0603  [CAP 0603 (0201_INCH)]
C?#87  100nF/16V/1608  [CAP 1608 (0603_INCH)]
C?#88  100nF/16V/1608  [CAP 1608 (0603_INCH)]
C?#89  100nF/16V/1608  [CAP 1608 (0603_INCH)]
C?#90  100nF/16V/1608  [CAP 1608 (0603_INCH)]
C?#91  4.7uF/16V/1608  [CAP 1608 (0603_INCH)]
C?#92  100nF/16V/1608  [CAP 1608 (0603_INCH)]
C?#93  100nF/16V/1608  [CAP 1608 (0603_INCH)]
C?#94  100nF/16V/1608  [CAP 1608 (0603_INCH)]
C?#95  100nF/16V/1608  [CAP 1608 (0603_INCH)]
C?#96  4.7uF/16V/1608  [CAP 1608 (0603_INCH)]
C?#97  100nF/50V/1608  [CAP 1608 (0603_INCH)]
C?#98  100nF/16V/1608  [CAP 1608 (0603_INCH)]
C?#99  100nF/16V/1608  [CAP 1608 (0603_INCH)]
CN?#2  Digilent HS2 HEADER
CN?#3  MC-311S  [CON USB-Type-C (16P)]
D?#2  SS210  [DIO DO-214AC (SMA)]
ESD?#1  CG0402MLU-3.3G  [RES 1005 (0402_inch)]
ESD?#2  CG0402MLU-3.3G  [RES 1005 (0402_inch)]
ESD?#3  CG0402MLU-3.3G  [RES 1005 (0402_inch)]
ESD?#4  CG0402MLU-3.3G  [RES 1005 (0402_inch)]
ESD?#5  CG0402MLU-3.3G  [RES 1005 (0402_inch)]
ESD?#6  CG0402MLU-3.3G  [RES 1005 (0402_inch)]
FB?#2  BLM15PX121SN1D  [FB 1005 (0402_inch)]
FB?#3  BLM15PX121SN1D  [FB 1005 (0402_inch)]
FB?#4  BLM15PX121SN1D  [FB 1005 (0402_inch)]
LED?#2  GREEN/2012  [LED MHT170RGBCT (GREEN)]
LED?#3  BLUE/2012  [LED MHT170RGBCT (BLUE)]
LED?#4  BLUE/2012  [LED MHT170RGBCT (BLUE)]
LED?#5  BLUE/2012  [LED MHT170RGBCT (BLUE)]
Q?#2  2N7002  [SOT 23-3 (DIODES INCORPORATED)]
R?#29  4.7K/1608  [RES 1608 (0603_inch)]
R?#30  4.7K/1608  [RES 1608 (0603_inch)]
R?#31  4.7K/1608  [RES 1608 (0603_inch)]
R?#32  4.7K/1608  [RES 1608 (0603_inch)]
R?#33  4.7K/1608  [RES 1608 (0603_inch)]
R?#34  22R/1608  [RES 1608 (0603_inch)]
R?#35  22R/1608  [RES 1608 (0603_inch)]
R?#36  22R/1608  [RES 1608 (0603_inch)]
R?#37  22R/1608  [RES 1608 (0603_inch)]
R?#38  510R/1608  [RES 1608 (0603_inch)]
R?#39  22R/1608  [RES 1608 (0603_inch)]
R?#40  22R/1608  [RES 1608 (0603_inch)]
R?#41  22R/1608  [RES 1608 (0603_inch)]
R?#42  22R/1608  [RES 1608 (0603_inch)]
R?#43  22R/1608  [RES 1608 (0603_inch)]
R?#44  100K/1608  [RES 1608 (0603_inch)]
R?#45  5.1K/1608  [RES 1608 (0603_inch)]
R?#46  5.1K/1608  [RES 1608 (0603_inch)]
R?#47  510R/1608  [RES 1608 (0603_inch)]
R?#48  510R/1608  [RES 1608 (0603_inch)]
R?#49  22R/1608  [RES 1608 (0603_inch)]
R?#50  22R/1608  [RES 1608 (0603_inch)]
R?#51  100K/1608  [RES 1608 (0603_inch)]
R?#52  12K/1608  [RES 1608 (0603_inch)]
R?#53  1M/1608/0.1W  [RES 1608 (0603_inch)]
R?#54  0R/1608/NC  [RES 1608 (0603_inch)/NC]
R?#55  0R/1608/NC  [RES 1608 (0603_inch)/NC]
R?#56  12K/1608  [RES 1608 (0603_inch)]
R?#57  20K/1608  [RES 1608 (0603_inch)]
R?#58  20K/1608  [RES 1608 (0603_inch)]
R?#59  20K/1608  [RES 1608 (0603_inch)]
R?#60  12K/1608  [RES 1608 (0603_inch)]
R?#61  12K/1608  [RES 1608 (0603_inch)]
R?#62  2.2K/1608  [RES 1608 (0603_inch)]
R?#63  20K/1608  [RES 1608 (0603_inch)]
R?#64  680R/2012  [RES 2012 (0805_inch)]
R?#65  1K/1608  [RES 1608 (0603_inch)]
R?#66  1K/1608  [RES 1608 (0603_inch)]
R?#67  20K/1608  [RES 1608 (0603_inch)]
R?#68  1K/1608  [RES 1608 (0603_inch)]
R?#69  1K/1608  [RES 1608 (0603_inch)]
R?#70  1K/1608  [RES 1608 (0603_inch)]
R?#71  22R/1608  [RES 1608 (0603_inch)]
SW?#1  TACT_SW  [SW K2-1102SP-C4SC-04]
SW?#2  DSHP03TS-S  [SW YSS-1201S-2mm]
U?#11  XC7Z010-1CLG400I  (part H of 9)
U?#12  FT2232HL-REEL
U?#13  93LC56B-I/SN
X?#1  S2D12.000000B20F30T(12MHz)  [OSC SMD_2.5x2.0 (SCTF)]

### Blocks framed on the sheet
Zynq Config, JTAG: C?#86 CN?#2 ESD?#1-ESD?#4 LED?#2 Q?#2 R?#29-R?#38 SW?#1 U?#11
FTDI JTAG Programmer and USB-to-UART: C?#81-C?#85 C?#87-C?#99 CN?#3 D?#2 ESD?#5 ESD?#6 FB?#2-FB?#4 LED?#3-LED?#5 R?#39-R?#53 R?#56 R?#60-R?#62 R?#64 R?#71 U?#12 U?#13 X?#1
Boot Mode MIO Strapping Pins (UG585 p167): R?#54 R?#55 R?#57-R?#59 R?#63 R?#65-R?#70 SW?#2

### Nets
+1.8V_FTDI: C?#81.2 C?#82.2 C?#83.2 C?#96.2 U?#12.12(VCORE) U?#12.37(VCORE) U?#12.49(VREGOUT) U?#12.64(VCORE)
+3.3V: C?#86.2 C?#87.2 C?#88.2 C?#89.2 C?#90.2 C?#95.2 C?#98.2 C?#99.2 CN?#2.6(VDD) FB?#2.1 FB?#3.1 R?#29.2 R?#30.2 R?#31.2 R?#32.2 R?#33.2 R?#38.2 R?#47.2 R?#48.2 R?#54.2 R?#55.2 R?#56.2 R?#60.2 R?#61.2 SW?#2.4 SW?#2.5 SW?#2.6 U?#11.M6(CFGBVS_0) U?#12.20(VCCIO) U?#12.31(VCCIO) U?#12.42(VCCIO) U?#12.50(VREGIN) U?#12.56(VCCIO) U?#13.8(VCC) X?#1.1(EN) X?#1.4(VDD)
+5V_USB: C?#93.2 CN?#3.A4(VBUS) CN?#3.B4(VBUS) FB?#4.1 LED?#5.4(Common_Anode)
+VCC: D?#2.2
GND: C?#81.1 C?#82.1 C?#83.1 C?#84.1 C?#85.1 C?#86.1 C?#87.1 C?#88.1 C?#89.1 C?#90.1 C?#91.1 C?#92.1 C?#93.1 C?#94.1 C?#95.1 C?#96.1 C?#97.2 C?#98.1 C?#99.1 CN?#2.5(GND) CN?#3.A1(GND) CN?#3.B1(GND) ESD?#1.1 ESD?#2.1 ESD?#3.1 ESD?#4.1 ESD?#5.1 ESD?#6.1 Q?#2.2(S) R?#45.1 R?#46.1 R?#51.1 R?#52.1 R?#53.2 R?#64.2 R?#65.1 R?#66.1 R?#68.1 R?#69.1 R?#70.1 SW?#1.3 U?#11.K9(VP_0) U?#11.K10(VREFN_0) U?#11.L9(VREFP_0) U?#11.L10(VN_0) U?#11.M9(DXP_0) U?#11.M10(DXN_0) U?#12.1(GND) U?#12.5(GND) U?#12.10(AGND) U?#12.11(GND) U?#12.13(TEST) U?#12.15(GND) U?#12.25(GND) U?#12.35(GND) U?#12.47(GND) U?#12.51(GND) U?#13.5(VSS) X?#1.2(GND)
CLK_12MHZ: R?#71.1 X?#1.3(OUT)
DONE: Q?#2.1(G) R?#31.1 U?#11.R11(DONE_0)
FLASH_CLK_M4: R?#59.2
FTDI_EECLK: R?#60.1 U?#12.62(EECLK) U?#13.2(CLK)
FTDI_EECS: R?#61.1 U?#12.63(EECS) U?#13.1(CS)
FTDI_EEDATA: R?#62.2 U?#12.61(EEDATA) U?#13.3(DI)
FTDI_NPOR: R?#43.1 U?#12.22(ADBUS5)
FTDI_NRST: R?#44.1 R?#51.2 U?#12.14(RESET#)
FTDI_OSCI: R?#71.2 U?#12.2(OSCI)
FTDI_REF: R?#52.2 U?#12.6(REF)
FTDI_RX: R?#50.1 U?#12.39(BDBUS1)
FTDI_RX_LED_A: LED?#3.4(Common_Anode) R?#47.1
FTDI_RX_LED_K: LED?#3.3(BLUE) U?#12.54(BCBUS3)
FTDI_TCK: R?#39.1 U?#12.16(ADBUS0)
FTDI_TDI: R?#40.1 U?#12.17(ADBUS1)
FTDI_TDO: R?#41.1 U?#12.18(ADBUS2)
FTDI_TMS: R?#42.1 U?#12.19(ADBUS3)
FTDI_TX: R?#49.1 U?#12.38(BDBUS0)
FTDI_TX_LED_A: LED?#4.4(Common_Anode) R?#48.1
FTDI_TX_LED_K: LED?#4.3(BLUE) U?#12.55(BCBUS4)
FTDI_VPHY: C?#91.2 C?#92.2 FB?#3.2 U?#12.4(VPHY)
FTDI_VPLL: C?#84.2 C?#85.2 FB?#2.2 U?#12.9(VPLL)
JTAG_TCK: CN?#2.4(TCK) ESD?#3.2 R?#36.2
JTAG_TDI: CN?#2.2(TDI) ESD?#1.2 R?#34.2
JTAG_TDO: CN?#2.3(TDO) ESD?#2.2 R?#35.2
JTAG_TMS: CN?#2.1(TMS) ESD?#4.2 R?#37.2
LED_DONE_A: LED?#2.4(Common_Anode) R?#38.1
LED_DONE_K: LED?#2.2(GREEN) Q?#2.3(D)
M0: R?#57.1 R?#68.2 SW?#2.1
M1: R?#63.1 R?#69.2 SW?#2.2
M2: R?#67.1 R?#70.2 SW?#2.3
M3: R?#54.1 R?#58.1 R?#65.2
M4: R?#55.1 R?#59.1 R?#66.2
NINIT: R?#32.1 U?#11.R10(INIT_B_0)
NPROGRAM: R?#33.1 SW?#1.1 U?#11.L6(PROGRAM_B_0)
PS_NPOR: R?#43.2
PS_QSPI_DQ0_M3: R?#58.2
PS_QSPI_DQ1_M1: R?#63.2
PS_QSPI_DQ2_M2: R?#67.2
PS_QSPI_DQ3_M0: R?#57.2
TCK: R?#36.1 R?#39.2 U?#11.F9(TCK_0)
TDI: R?#29.1 R?#34.1 R?#40.2 U?#11.G6(TDI_0)
TDO: R?#35.1 R?#41.2 U?#11.F6(TDO_0)
TMS: R?#30.1 R?#37.1 R?#42.2 U?#11.J6(TMS_0)
UART0_RX: R?#49.2
UART0_TX: R?#50.2
USB_FTDI_D_N: CN?#3.A7(D-) CN?#3.B7(D-) ESD?#6.2 U?#12.7(DM)
USB_FTDI_D_P: CN?#3.A6(D+) CN?#3.B6(D+) ESD?#5.2 U?#12.8(DP)
VUSB_FILT: C?#94.2 D?#2.1 FB?#4.2 R?#44.2
NetC?#97_1: C?#97.1 CN?#3.S1(SHIELD) CN?#3.S2(SHIELD) CN?#3.S3(SHIELD) CN?#3.S4(SHIELD) R?#53.1
NetCN?#3_A5: CN?#3.A5(CC1) R?#46.2
NetCN?#3_B5: CN?#3.B5(CC2) R?#45.2
NetLED?#5_3: LED?#5.3(BLUE) R?#64.1
NetR?#56_1: R?#56.1 R?#62.1 U?#13.4(DO)

Not connected (* = marked no-connect by the designer): CN?#3 A8(SBU1)* B8(SBU2)*; U?#12 3(OSCO)* 21(ADBUS4)* 23(ADBUS6)* 24(ADBUS7)* 26(ACBUS0)* 27(ACBUS1)* 28(ACBUS2) 29(ACBUS3) 30(ACBUS4)* 32(ACBUS5)* 33(ACBUS6)* 34(ACBUS7)* 36(SUSPEND#)* 40(BDBUS2)* 41(BDBUS3)* 43(BDBUS4)* 44(BDBUS5)* 45(BDBUS6)* 46(BDBUS7)* 48(BCBUS0)* 52(BCBUS1)* 53(BCBUS2)* 57(BCBUS5)* 58(BCBUS6)* 59(BCBUS7)* 60(PWREN#)*; U?#13 6(NC)* 7(NC)*

### Layout directives
differential pair; differential pair class DIFF90: USB_FTDI_D_N, USB_FTDI_D_P

### Notes on the sheet
- XC7Z010 Test B'd (Rev.A)
- [6] Zynq Config, JTAG, Debug
- [CFGBVS = 1] → VCC0 = 3.3V
- [VP = VN = GND] → Not used
- [VREFP = VREFN = GND] → On-chip Ref
- (near SW?#2) M[0  2  1] = Boot Mode
- (near R?#54) M3 → JTAG Cascade / Independent Mode
- M4 → PLL Bypass
- Title
- Rev
- Doc
- Sheet #
- of
- Author
- This document is copyright of ArkX and shall not be revealed, produced, copied, in whole or in part,
- Date
- nor used for any purpose other than submitted.
- (in symbol CON_Digilent_HS2_HEADER) JTAG Con
- (in symbol IC_SOC_XC7Z010-1CLG400I, part H) JTAG
- (in symbol SW_DSHP03TS-S) ON

### Library data of the parts
C?#81-C?#83 C?#85 C?#87-C?#90 C?#92-C?#95 C?#98 C?#99 = CAP_100nF/16V/1608: Ceramic CAP_100nF/16V/1608; LCSC Part #: C66501; JLCPCB Part Type: Extended Part
C?#84 C?#91 C?#96 = CAP_4.7uF/16V/1608: Ceramic CAP_4.7uF/16V/1608; LCSC Part #: C19666; JLCPCB Part Type: Basic Part
C?#86 = CAP_100nF/25V/0603: Ceramic CAP_100nF/25V/0603; JLCPCB Part Type: Extended Part; LCSC Part #: C181047
C?#97 = CAP_100nF/50V/1608: Ceramic CAP_100nF/50V/1608; LCSC Part #: C14663; JLCPCB Part Type: Basic Part
CN?#2 = CON_Digilent_HS2_HEADER: 2.54mm pitch 6pin-header for Digilent HS2 Cable
CN?#3 = CON_USB-Type-C: USB 2.0 5A 1 Surface Mount 16 Female -35℃~+75℃ Type-C SMD  USB Connectors ROHS; LCSC Part #: C2977718; JLCPCB Part Type: Extended Part
D?#2 = DIO_SS210: as D?#1 on sheet 03_Power; LCSC Part #: C14996; JLCPCB Part Type: Basic Part
ESD?#1-ESD?#6 = ESD_CG0402MLU-3.3G: Varistor 1 Circuit Surface Mount, MLCV 0402 (1005 Metric); LCSC Part #: C2655393; JLCPCB Part Type: Extended Part
FB?#2-FB?#4 = FB_BLM15PX121SN1D: as FB?#1 on sheet 04_Zynq_Power; LCSC Part #: C88970; JLCPCB Part Type: Extended Part
LED?#2 = LED_MHT170RGBCT(GREEN): as LED?#1 on sheet 03_Power; LCSC Part #: C2962094; JLCPCB Part Type: Extended Part
LED?#3-LED?#5 = LED_MHT170RGBCT(BLUE): Colorless transparence -30℃~+85℃ Positive post Common anode RGB 120° 0805  Light Emitting Diodes (LED) ROHS; LCSC Part #: C2962094; JLCPCB Part Type: Extended Part
Q?#2 = FET_2N7002: as Q?#1 on sheet 03_Power; LCSC Part #: C8545; JLCPCB Part Type: Basic Part
R?#29-R?#33 = RES_4.7K/1608/0.1W: as R?#8 on sheet 03_Power; Size: 1608; LCSC Part #: C23162; JLCPCB Part Type: Basic Part
R?#34-R?#37 R?#39-R?#43 R?#49 R?#50 R?#71 = RES_22R/1608/0.1W: Value: 22R; Power Rating: 0.1W; Precision: 1%; Size: 1608; LCSC Part #: C23345; JLCPCB Part Type: Basic Part
R?#38 R?#47 R?#48 = RES_510R/1608/0.1W: Value: 510R; Power Rating: 0.1W; Precision: 1%; Size: 1608; LCSC Part #: C23193; JLCPCB Part Type: Basic Part
R?#44 R?#51 = RES_100K/1608/0.1W: as R?#4 on sheet 03_Power; Size: 1608; LCSC Part #: C25803; JLCPCB Part Type: Basic Part
R?#45 R?#46 = RES_5.1K/1608/0.1W: Value: 5.1K; Power Rating: 0.1W; Precision: 1%; Size: 1608; LCSC Part #: C23186; JLCPCB Part Type: Basic Part
R?#52 R?#56 R?#60 R?#61 = RES_12K/1608/0.1W: as R?#2 on sheet 03_Power; Size: 1608; LCSC Part #: C22790; JLCPCB Part Type: Basic Part
R?#53 = RES_1M/1608/0.1W: Value: 1M; Power Rating: 0.1W; Precision: 1%; Size: 1608; LCSC Part #: C22935; JLCPCB Part Type: Basic Part
R?#54 R?#55 = RES_NC_0R/1608/0.1W: 0R/1608/0.1W/NC; Value: 0R; Power Rating: 0.1W; Precision: 1%; Size: 1608
R?#57-R?#59 R?#63 R?#67 = RES_20K/1608/0.1W: Value: 20K; Power Rating: 0.1W; Precision: 1%; Size: 1608; LCSC Part #: C4184; JLCPCB Part Type: Basic Part
R?#62 = RES_2.2K/1608/0.1W: Value: 2.2K; Power Rating: 0.1W; Precision: 1%; Size: 1608; LCSC Part #: C4190; JLCPCB Part Type: Basic Part
R?#64 = RES_680R/2012/0.125W: Value: 680R; Power Rating: 0.125W; Precision: 1%; Size: 2012; LCSC Part #: C17798; JLCPCB Part Type: Basic Part
R?#65 R?#66 R?#68-R?#70 = RES_1K/1608/0.1W: as R?#20 on sheet 03_Power; Size: 1608; LCSC Part #: C21190; JLCPCB Part Type: Basic Part
SW?#1 = SW_K2-1102SP-C4SC-04(2P): -25℃~+85℃ 6mm 5mm Round Button 50mA Brick nogging 6mm SPST 100MΩ 100000 250gf@±30gf 12V SMD  Tactile Switches ROHS; LCSC Part #: C127509; JLCPCB Part Type: Extended Part
SW?#2 = SW_DSHP03TS-S: 3Bit SPST 24V 25mA Black 3000次 Slide (Standard), SMD-6P,5.4x5.4mm  DIP Switches ROHS; LCSC Part #: C319051; JLCPCB Part Type: Extended Part
U?#11 = IC_SOC_XC7Z010-1CLG400I: as U?#7 on sheet 04_Zynq_Power
U?#12 = IC_USB_FT2232HL-REEL: USB Bridge, USB to UART,FIFO USB 2.0 UART Interface 64-LQFP (10x10); LCSC Part #: C27882; JLCPCB Part Type: Extended Part
U?#13 = IC_EEPROM_93LC56B-I/SN: EEPROM Memory IC 2Kbit Microwire 2 MHz 8-SOIC; LCSC Part #: C183620; JLCPCB Part Type: Extended Part
X?#1 = OSC_S2D12.000000B20F30T(12MHz): 3.3V~3.3V -40℃~+85℃ 20mA ±20ppm 12MHz SMD2520-4P  Oscillators ROHS; LCSC Part #: C387449; JLCPCB Part Type: Extended Part

## Sheet 06_Zynq_PS.SchDoc
size A3; SheetNumber: 7; SheetTotal: 11
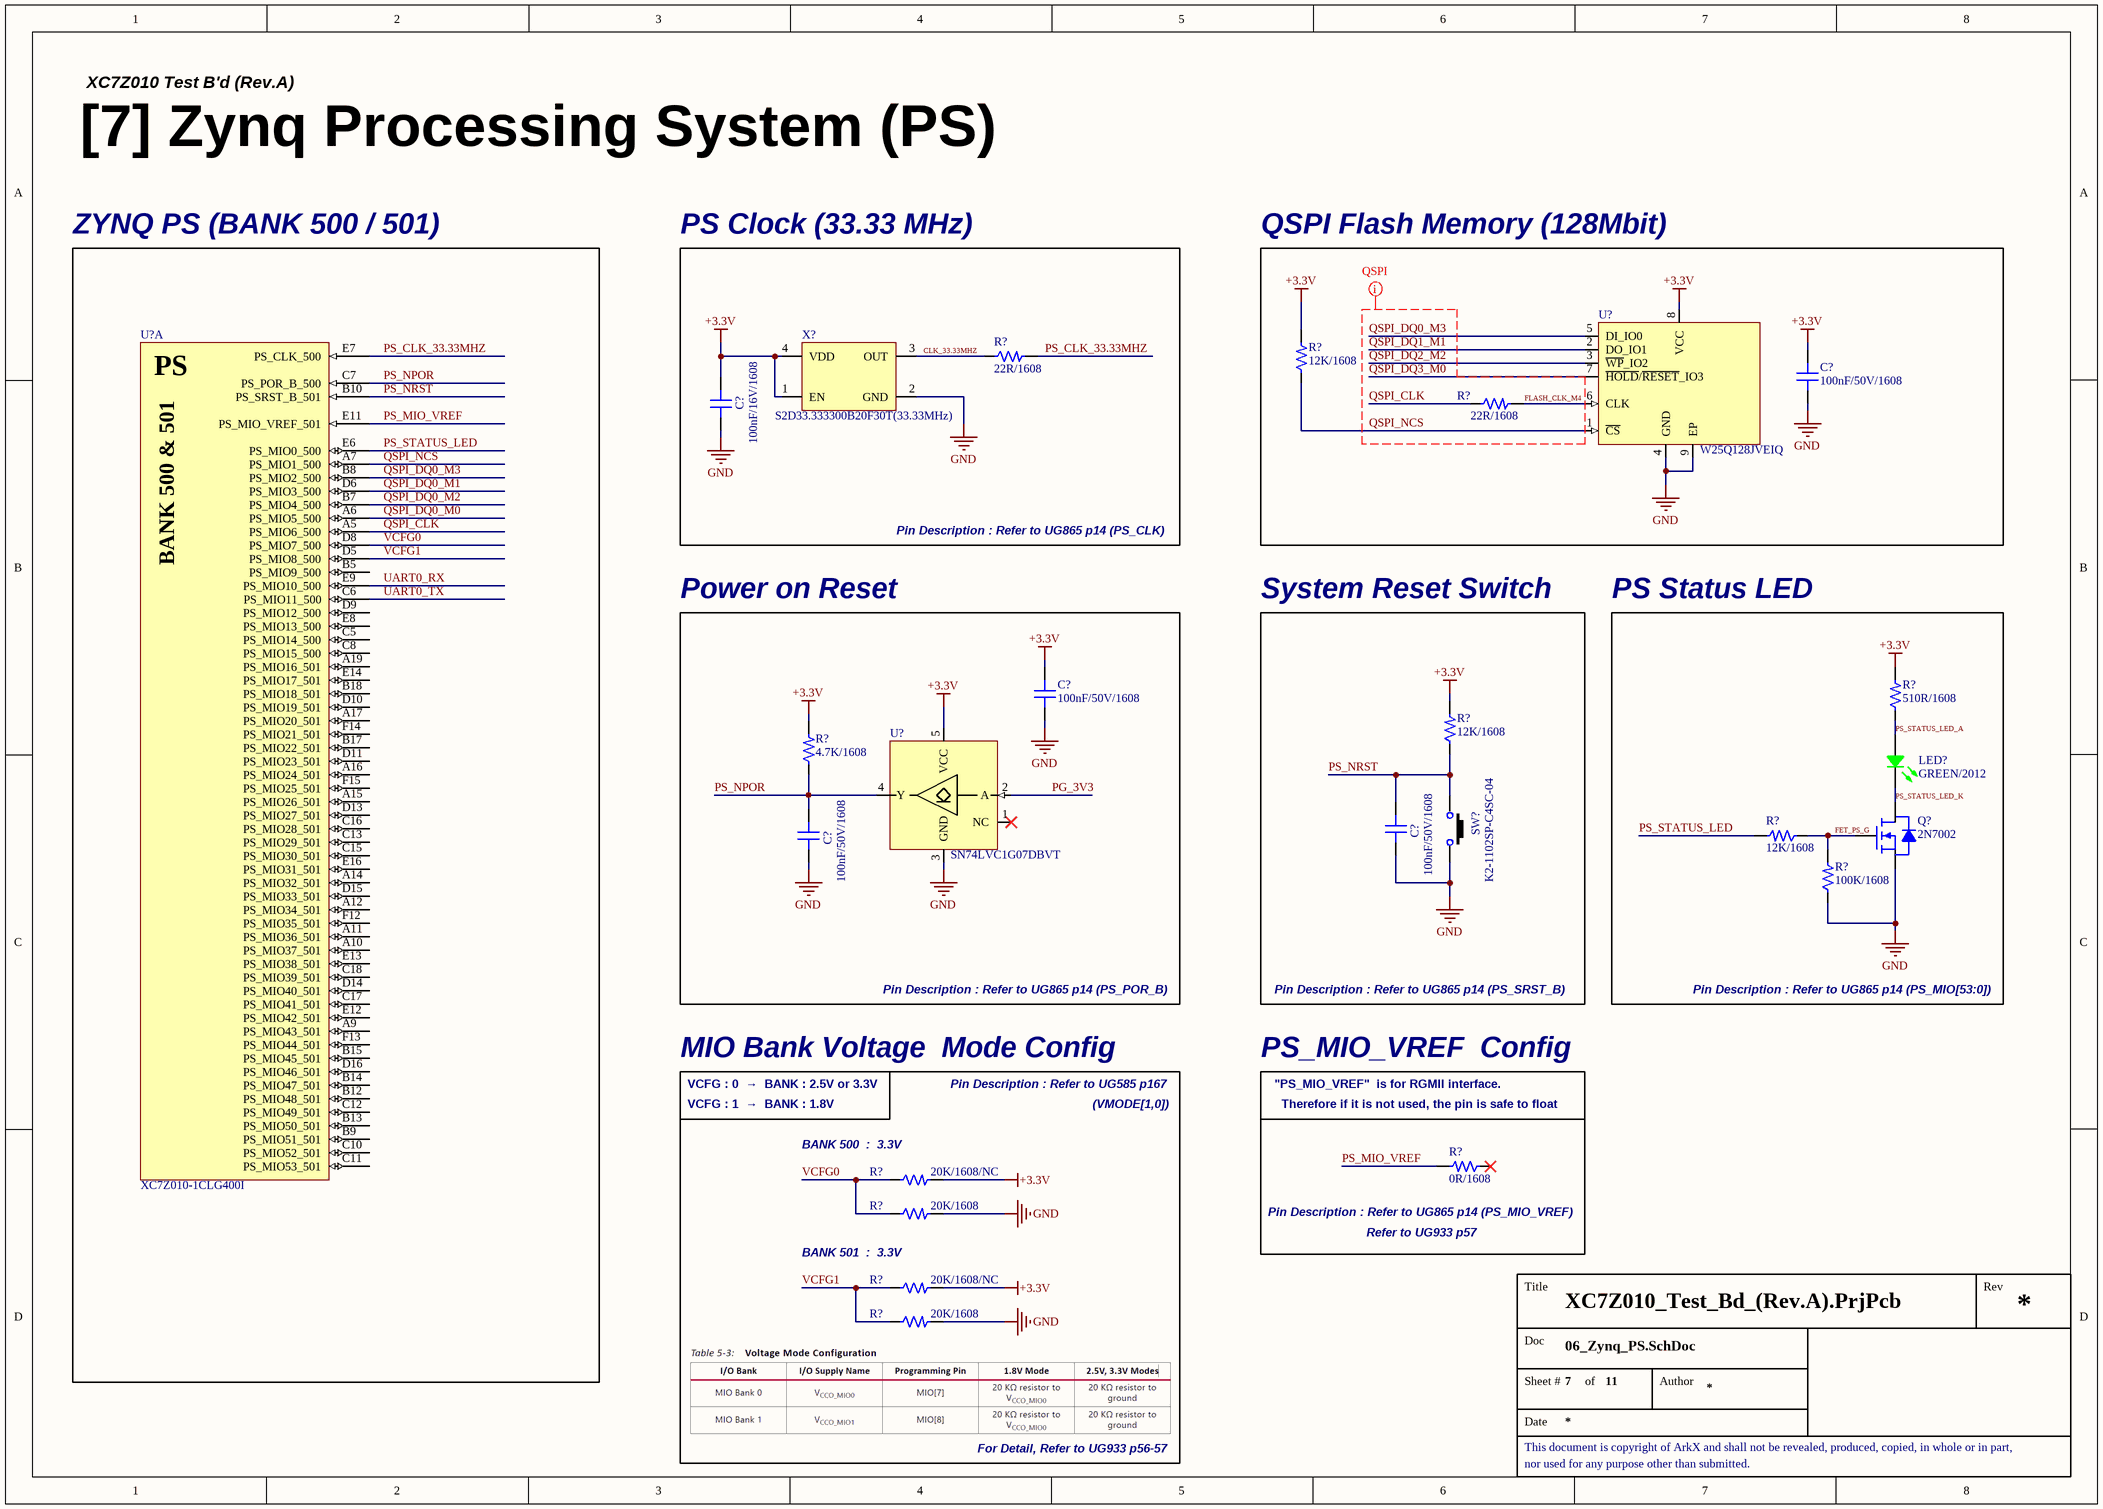
[diagram p7: 06_Zynq_PS.SchDoc]

### Parts
(Parts that share a designator on the sheet are numbered #1, #2 ... from top to bottom, then left to right.)
C?#100  100nF/50V/1608  [CAP 1608 (0603_INCH)]
C?#101  100nF/16V/1608  [CAP 1608 (0603_INCH)]
C?#102  100nF/50V/1608  [CAP 1608 (0603_INCH)]
C?#103  100nF/50V/1608  [CAP 1608 (0603_INCH)]
C?#104  100nF/50V/1608  [CAP 1608 (0603_INCH)]
LED?#6  GREEN/2012  [LED MHT170RGBCT (GREEN)]
Q?#3  2N7002  [SOT 23-3 (DIODES INCORPORATED)]
R?#72  22R/1608  [RES 1608 (0603_inch)]
R?#73  12K/1608  [RES 1608 (0603_inch)]
R?#74  22R/1608  [RES 1608 (0603_inch)]
R?#75  510R/1608  [RES 1608 (0603_inch)]
R?#76  12K/1608  [RES 1608 (0603_inch)]
R?#77  4.7K/1608  [RES 1608 (0603_inch)]
R?#78  12K/1608  [RES 1608 (0603_inch)]
R?#79  100K/1608  [RES 1608 (0603_inch)]
R?#80  0R/1608  [RES 1608 (0603_inch)]
R?#81  20K/1608/NC  [RES 1608 (0603_inch)/NC]
R?#82  20K/1608  [RES 1608 (0603_inch)]
R?#83  20K/1608/NC  [RES 1608 (0603_inch)/NC]
R?#84  20K/1608  [RES 1608 (0603_inch)]
SW?#3  K2-1102SP-C4SC-04  [SW K2-1102SP-C4SC-04]
U?#14  XC7Z010-1CLG400I  (part A of 9)
U?#15  W25Q128JVEIQ  [IC_WSON-8-8X6]
U?#16  SN74LVC1G07DBVT  [SOT-23-5 (TI DBV PACKAGE)]
X?#2  S2D33.333300B20F30T(33.33MHz)  [OSC SMD_2.5x2.0 (SCTF)]

### Blocks framed on the sheet
ZYNQ PS (BANK 500 / 501): U?#14
PS Clock (33.33 MHz): C?#101 R?#72 X?#2
QSPI Flash Memory (128Mbit): C?#100 R?#73 R?#74 U?#15
Power on Reset: C?#102 C?#104 R?#77 U?#16
System Reset Switch: C?#103 R?#76 SW?#3
PS Status LED: LED?#6 Q?#3 R?#75 R?#78 R?#79
MIO Bank Voltage  Mode Config: R?#81-R?#84
PS_MIO_VREF  Config: R?#80

### Nets
+3.3V: C?#100.1 C?#101.2 C?#102.1 R?#73.2 R?#75.2 R?#76.2 R?#77.2 R?#81.2 R?#83.2 U?#15.8(VCC) U?#16.5(VCC) X?#2.1(EN) X?#2.4(VDD)
GND: C?#100.2 C?#101.1 C?#102.2 C?#103.1 C?#104.1 Q?#3.2(S) R?#79.1 R?#82.2 R?#84.2 SW?#3.1 U?#15.4(GND) U?#15.9(EP) U?#16.3(GND) X?#2.2(GND)
CLK_33.33MHZ: R?#72.1 X?#2.3(OUT)
FET_PS_G: Q?#3.1(G) R?#78.1 R?#79.2
FLASH_CLK_M4: R?#74.2 U?#15.6(CLK)
PG_3V3: U?#16.2(A)
PS_CLK_33.33MHZ: R?#72.2 U?#14.E7(PS_CLK_500)
PS_MIO_VREF: R?#80.2 U?#14.E11(PS_MIO_VREF_501)
PS_NPOR: C?#104.2 R?#77.1 U?#14.C7(PS_POR_B_500) U?#16.4(Y)
PS_NRST: C?#103.2 R?#76.1 SW?#3.3 U?#14.B10(PS_SRST_B_501)
PS_STATUS_LED: R?#78.2 U?#14.E6(PS_MIO0_500)
PS_STATUS_LED_A: LED?#6.4(Common_Anode) R?#75.1
PS_STATUS_LED_K: LED?#6.2(GREEN) Q?#3.3(D)
QSPI_CLK: R?#74.1 U?#14.A5(PS_MIO6_500)
QSPI_DQ0_M0: U?#14.A6(PS_MIO5_500)
QSPI_DQ0_M1: U?#14.D6(PS_MIO3_500)
QSPI_DQ0_M2: U?#14.B7(PS_MIO4_500)
QSPI_DQ0_M3: U?#14.B8(PS_MIO2_500) U?#15.5(DI_IO0)
QSPI_DQ1_M1: U?#15.2(DO_IO1)
QSPI_DQ2_M2: U?#15.3(~{WP}_IO2)
QSPI_DQ3_M0: U?#15.7(~{HOLD}/~{RESET}_IO3)
QSPI_NCS: R?#73.1 U?#14.A7(PS_MIO1_500) U?#15.1(~{CS})
UART0_RX: U?#14.E9(PS_MIO10_500)
UART0_TX: U?#14.C6(PS_MIO11_500)
VCFG0: R?#81.1 R?#82.1 U?#14.D8(PS_MIO7_500)
VCFG1: R?#83.1 R?#84.1 U?#14.D5(PS_MIO8_500)

Not connected (* = marked no-connect by the designer): R?#80 1*; U?#14 A9(PS_MIO43_501) A10(PS_MIO37_501) A11(PS_MIO36_501) A12(PS_MIO34_501) A14(PS_MIO32_501) A15(PS_MIO26_501) A16(PS_MIO24_501) A17(PS_MIO20_501) A19(PS_MIO16_501) B5(PS_MIO9_500) B9(PS_MIO51_501) B12(PS_MIO48_501) B13(PS_MIO50_501) B14(PS_MIO47_501) B15(PS_MIO45_501) B17(PS_MIO22_501) B18(PS_MIO18_501) C5(PS_MIO14_500) C8(PS_MIO15_500) C10(PS_MIO52_501) C11(PS_MIO53_501) C12(PS_MIO49_501) C13(PS_MIO29_501) C15(PS_MIO30_501) C16(PS_MIO28_501) C17(PS_MIO41_501) C18(PS_MIO39_501) D9(PS_MIO12_500) D10(PS_MIO19_501) D11(PS_MIO23_501) D13(PS_MIO27_501) D14(PS_MIO40_501) D15(PS_MIO33_501) D16(PS_MIO46_501) E8(PS_MIO13_500) E12(PS_MIO42_501) E13(PS_MIO38_501) E14(PS_MIO17_501) E16(PS_MIO31_501) F12(PS_MIO35_501) F13(PS_MIO44_501) F14(PS_MIO21_501) F15(PS_MIO25_501); U?#16 1(NC)*

### Layout directives
rule Matched Net Lengths [Delay Tolerance = 20ps]; net class QSPI: FLASH_CLK_M4, QSPI_CLK, QSPI_DQ0_M3, QSPI_DQ1_M1, QSPI_DQ2_M2, QSPI_DQ3_M0, QSPI_NCS

### Notes on the sheet
- XC7Z010 Test B'd (Rev.A)
- [7] Zynq Processing System (PS)
- Pin Description : Refer to UG865 p14 (PS_CLK)
- Pin Description : Refer to UG865 p14 (PS_POR_B)
- Pin Description : Refer to UG865 p14 (PS_SRST_B)
- Pin Description : Refer to UG865 p14 (PS_MIO[53:0])
- VCFG : 0  →  BANK : 2.5V or 3.3V
- VCFG : 1  →  BANK : 1.8V
- Pin Description : Refer to UG585 p167
- (VMODE[1,0])
- "PS_MIO_VREF"  is for RGMII interface.
- Therefore if it is not used, the pin is safe to float
- (near R?#81) BANK 500  :  3.3V
- (near R?#83) BANK 501  :  3.3V
- (near R?#80) Pin Description : Refer to UG865 p14 (PS_MIO_VREF)
- Refer to UG933 p57
- For Detail, Refer to UG933 p56-57
- Title
- Rev
- Doc
- Sheet #
- of
- Author
- This document is copyright of ArkX and shall not be revealed, produced, copied, in whole or in part,
- Date
- nor used for any purpose other than submitted.
- (in symbol IC_SOC_XC7Z010-1CLG400I, part A) PS; BANK 500 & 501

### Library data of the parts
C?#100 C?#102-C?#104 = CAP_100nF/50V/1608: Ceramic CAP_100nF/50V/1608; LCSC Part #: C14663; JLCPCB Part Type: Basic Part
C?#101 = CAP_100nF/16V/1608: Ceramic CAP_100nF/16V/1608; LCSC Part #: C66501; JLCPCB Part Type: Extended Part
LED?#6 = LED_MHT170RGBCT(GREEN): as LED?#1 on sheet 03_Power; LCSC Part #: C2962094; JLCPCB Part Type: Extended Part
Q?#3 = FET_2N7002: as Q?#1 on sheet 03_Power; LCSC Part #: C8545; JLCPCB Part Type: Basic Part
R?#72 R?#74 = RES_22R/1608/0.1W: as R?#34 on sheet 05_Zynq_Config; Size: 1608; LCSC Part #: C23345; JLCPCB Part Type: Basic Part
R?#73 R?#76 R?#78 = RES_12K/1608/0.1W: as R?#2 on sheet 03_Power; Size: 1608; LCSC Part #: C22790; JLCPCB Part Type: Basic Part
R?#75 = RES_510R/1608/0.1W: as R?#38 on sheet 05_Zynq_Config; Size: 1608; LCSC Part #: C23193; JLCPCB Part Type: Basic Part
R?#77 = RES_4.7K/1608/0.1W: as R?#8 on sheet 03_Power; Size: 1608; LCSC Part #: C23162; JLCPCB Part Type: Basic Part
R?#79 = RES_100K/1608/0.1W: as R?#4 on sheet 03_Power; Size: 1608; LCSC Part #: C25803; JLCPCB Part Type: Basic Part
R?#80 = RES_0R/1608/0.1W: Value: 0R; Power Rating: 0.1W; Precision: 1%; Size: 1608; LCSC Part #: C21189; JLCPCB Part Type: Basic Part
R?#81 R?#83 = RES_NC_20K/1608/0.1W: RES_20K/1608/0.1W; Value: 100R; Power Rating: 0.1W; Precision: 1%; Size: 1608
R?#82 R?#84 = RES_20K/1608/0.1W: as R?#57 on sheet 05_Zynq_Config; Size: 1608; LCSC Part #: C4184; JLCPCB Part Type: Basic Part
SW?#3 = SW_K2-1102SP-C4SC-04(2P): as SW?#1 on sheet 05_Zynq_Config; LCSC Part #: C127509; JLCPCB Part Type: Extended Part
U?#14 = IC_SOC_XC7Z010-1CLG400I: as U?#7 on sheet 04_Zynq_Power
U?#15 = IC_MEM_W25Q128JVEIQ: 3V 128M-BIT SERIAL FLASH MEMORY WITH DUAL/QUAD SPI & QPI & DTR WSON-8; Manufacturer: Winbond; Manufacturer Part Number: W25Q128JVEIQ; LCSC Part #: C401662; JLCPCB Part Type: Extended Part
U?#16 = IC_BUF_SN74LVC1G07DBVT: Single Buffer/Driver With Open-Drain Output / IC BUF NON-INVERT 5.5V SOT23-5; LCSC Part #: C2867373; JLCPCB Part Type: Extended Part
X?#2 = OSC_S2D33.333300B20F30T(33.33MHz): 3.3V ±20ppm CMOS 33.3333MHz SMD2520-4P  Oscillators ROHS; LCSC Part #: C907622; JLCPCB Part Type: Extended Part

## Sheet Ref.00_Zynq_Power_Config_1.SchDoc
size A2; SheetNumber: 8; SheetTotal: 11
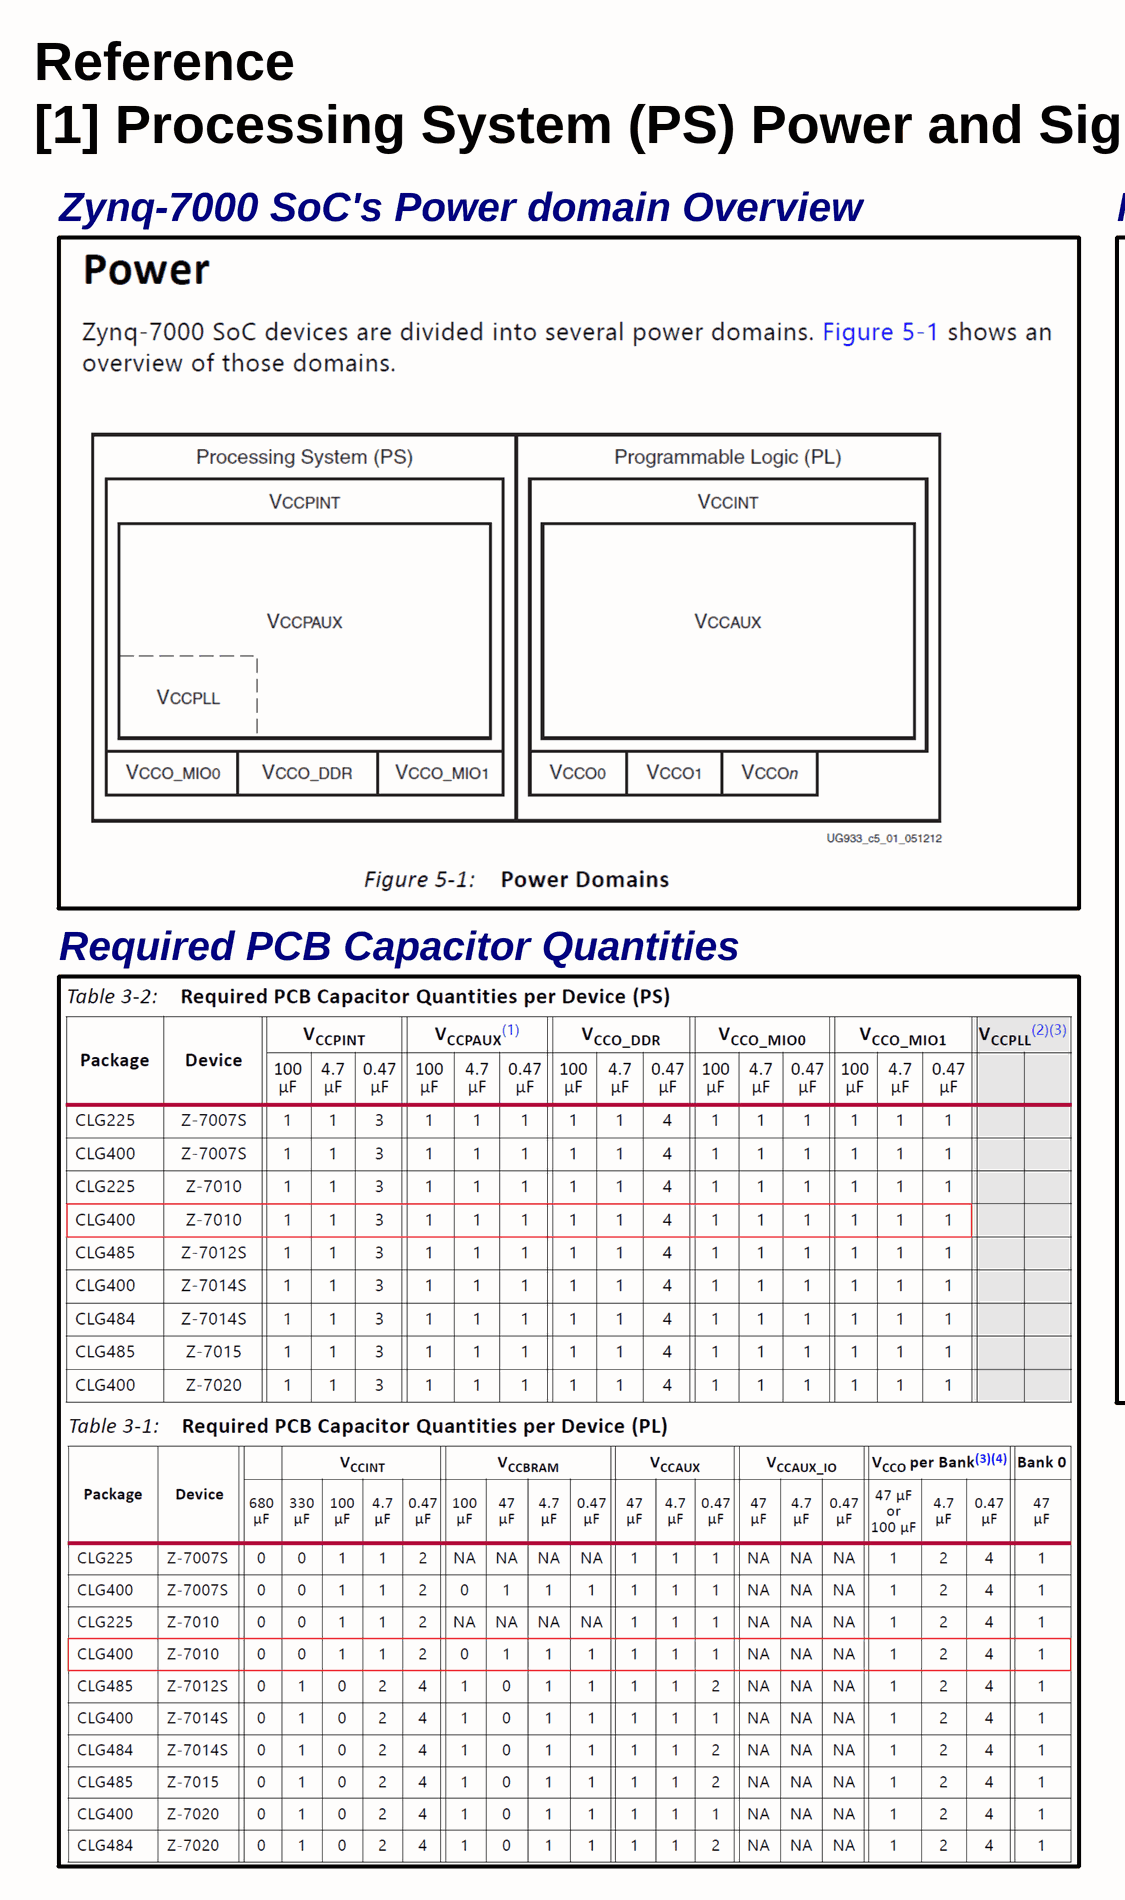
[diagram p8: Ref.00_Zynq_Power_Config_1.SchDoc, left]
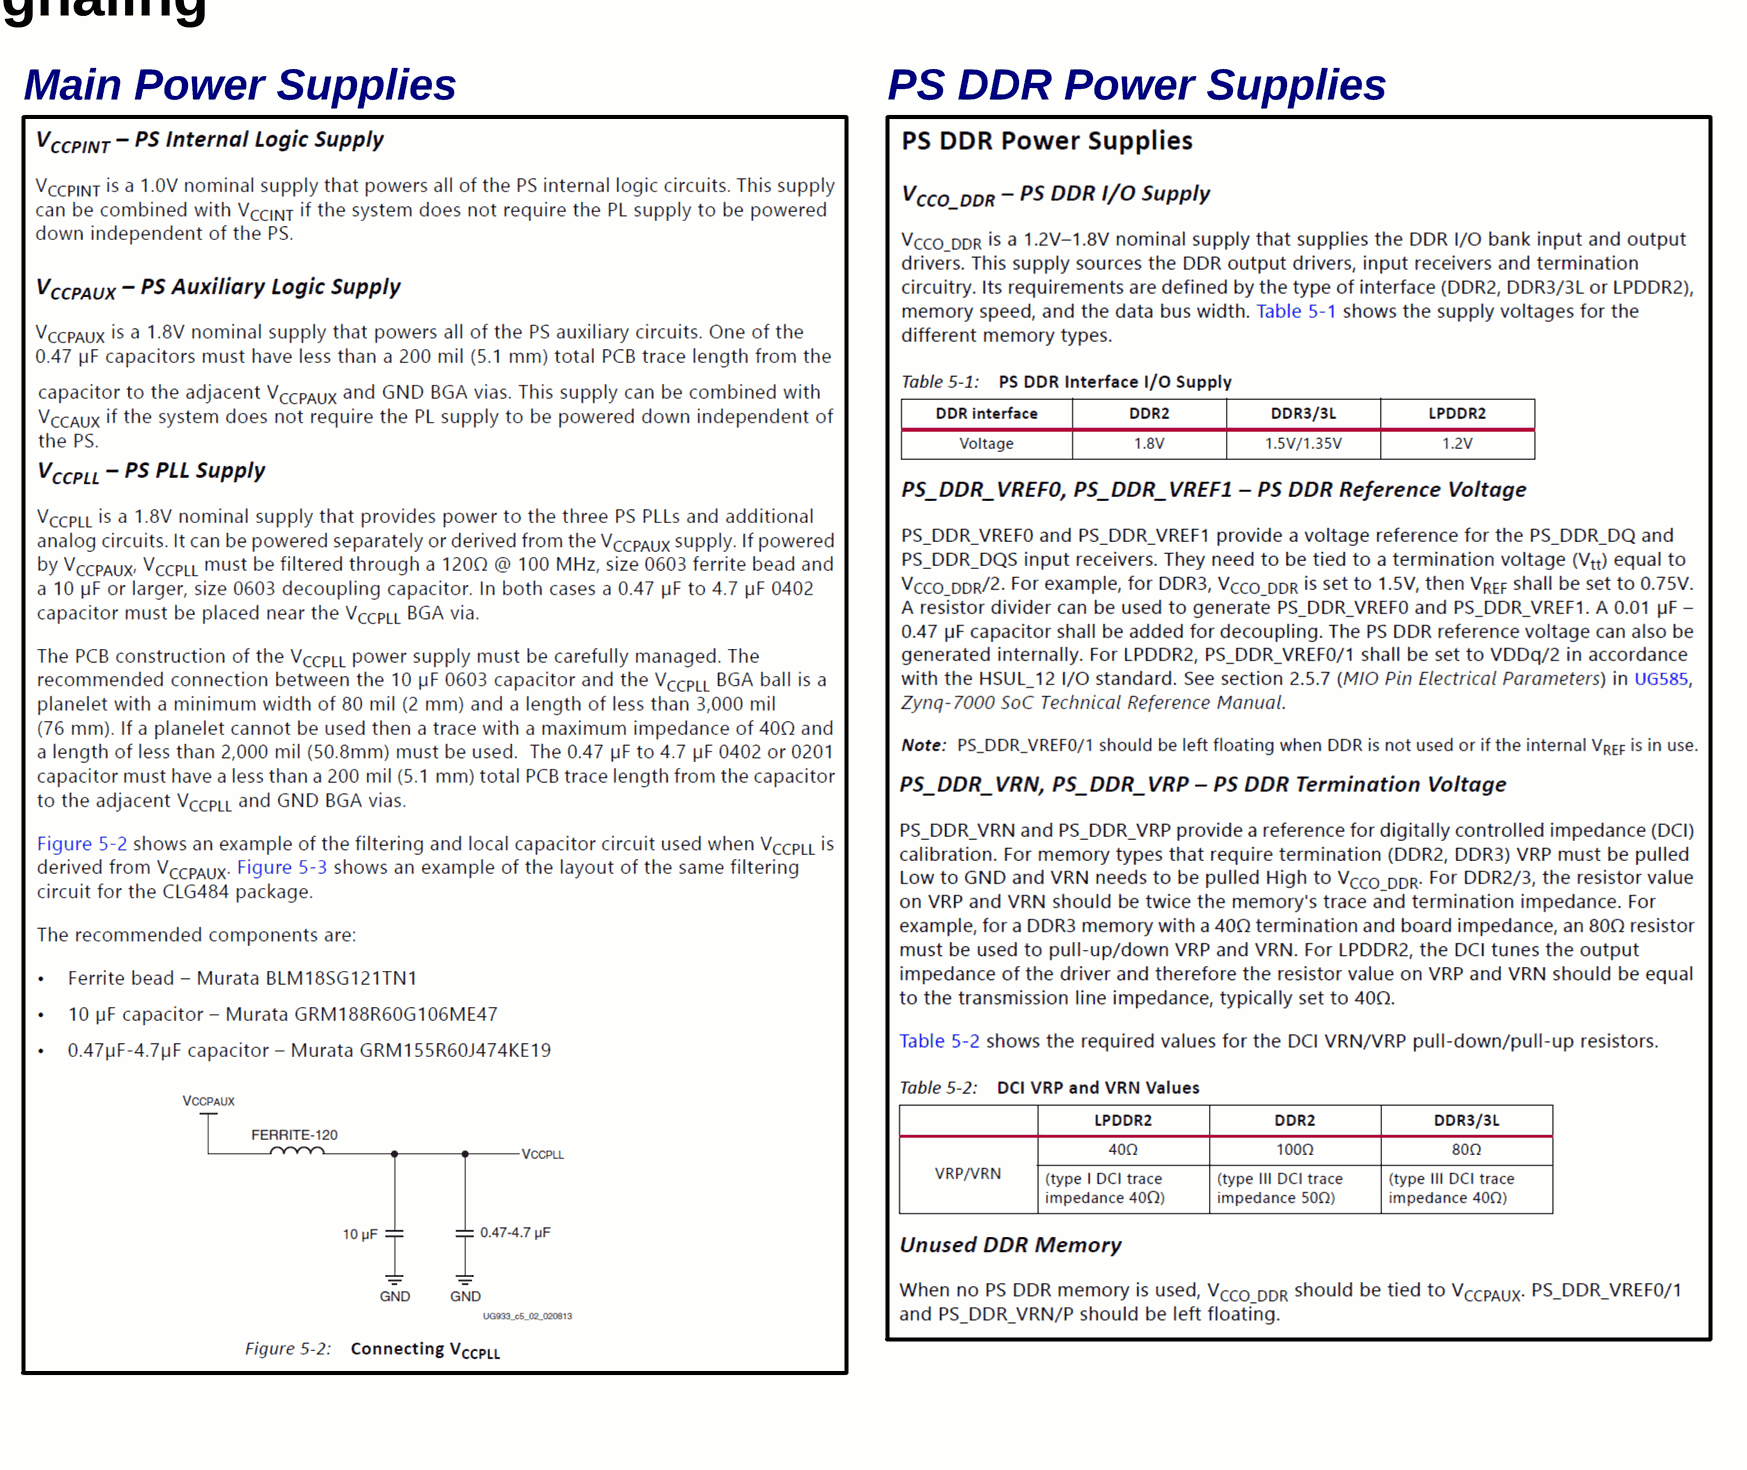
[diagram p9: Ref.00_Zynq_Power_Config_1.SchDoc, right]

### Notes on the sheet
- Reference
- [1] Processing System (PS) Power and Signaling
- Zynq-7000 SoC's Power domain Overview
- Main Power Supplies
- PS DDR Power Supplies
- Required PCB Capacitor Quantities
- Title
- Rev
- Doc
- Sheet #
- of
- Author
- This document is copyright of ArkX and shall not be revealed, produced, copied, in whole or in part,
- Date
- nor used for any purpose other than submitted.

## Sheet Ref.01_Zynq_Power_Config_2.SchDoc
size A2; SheetNumber: 9; SheetTotal: 11
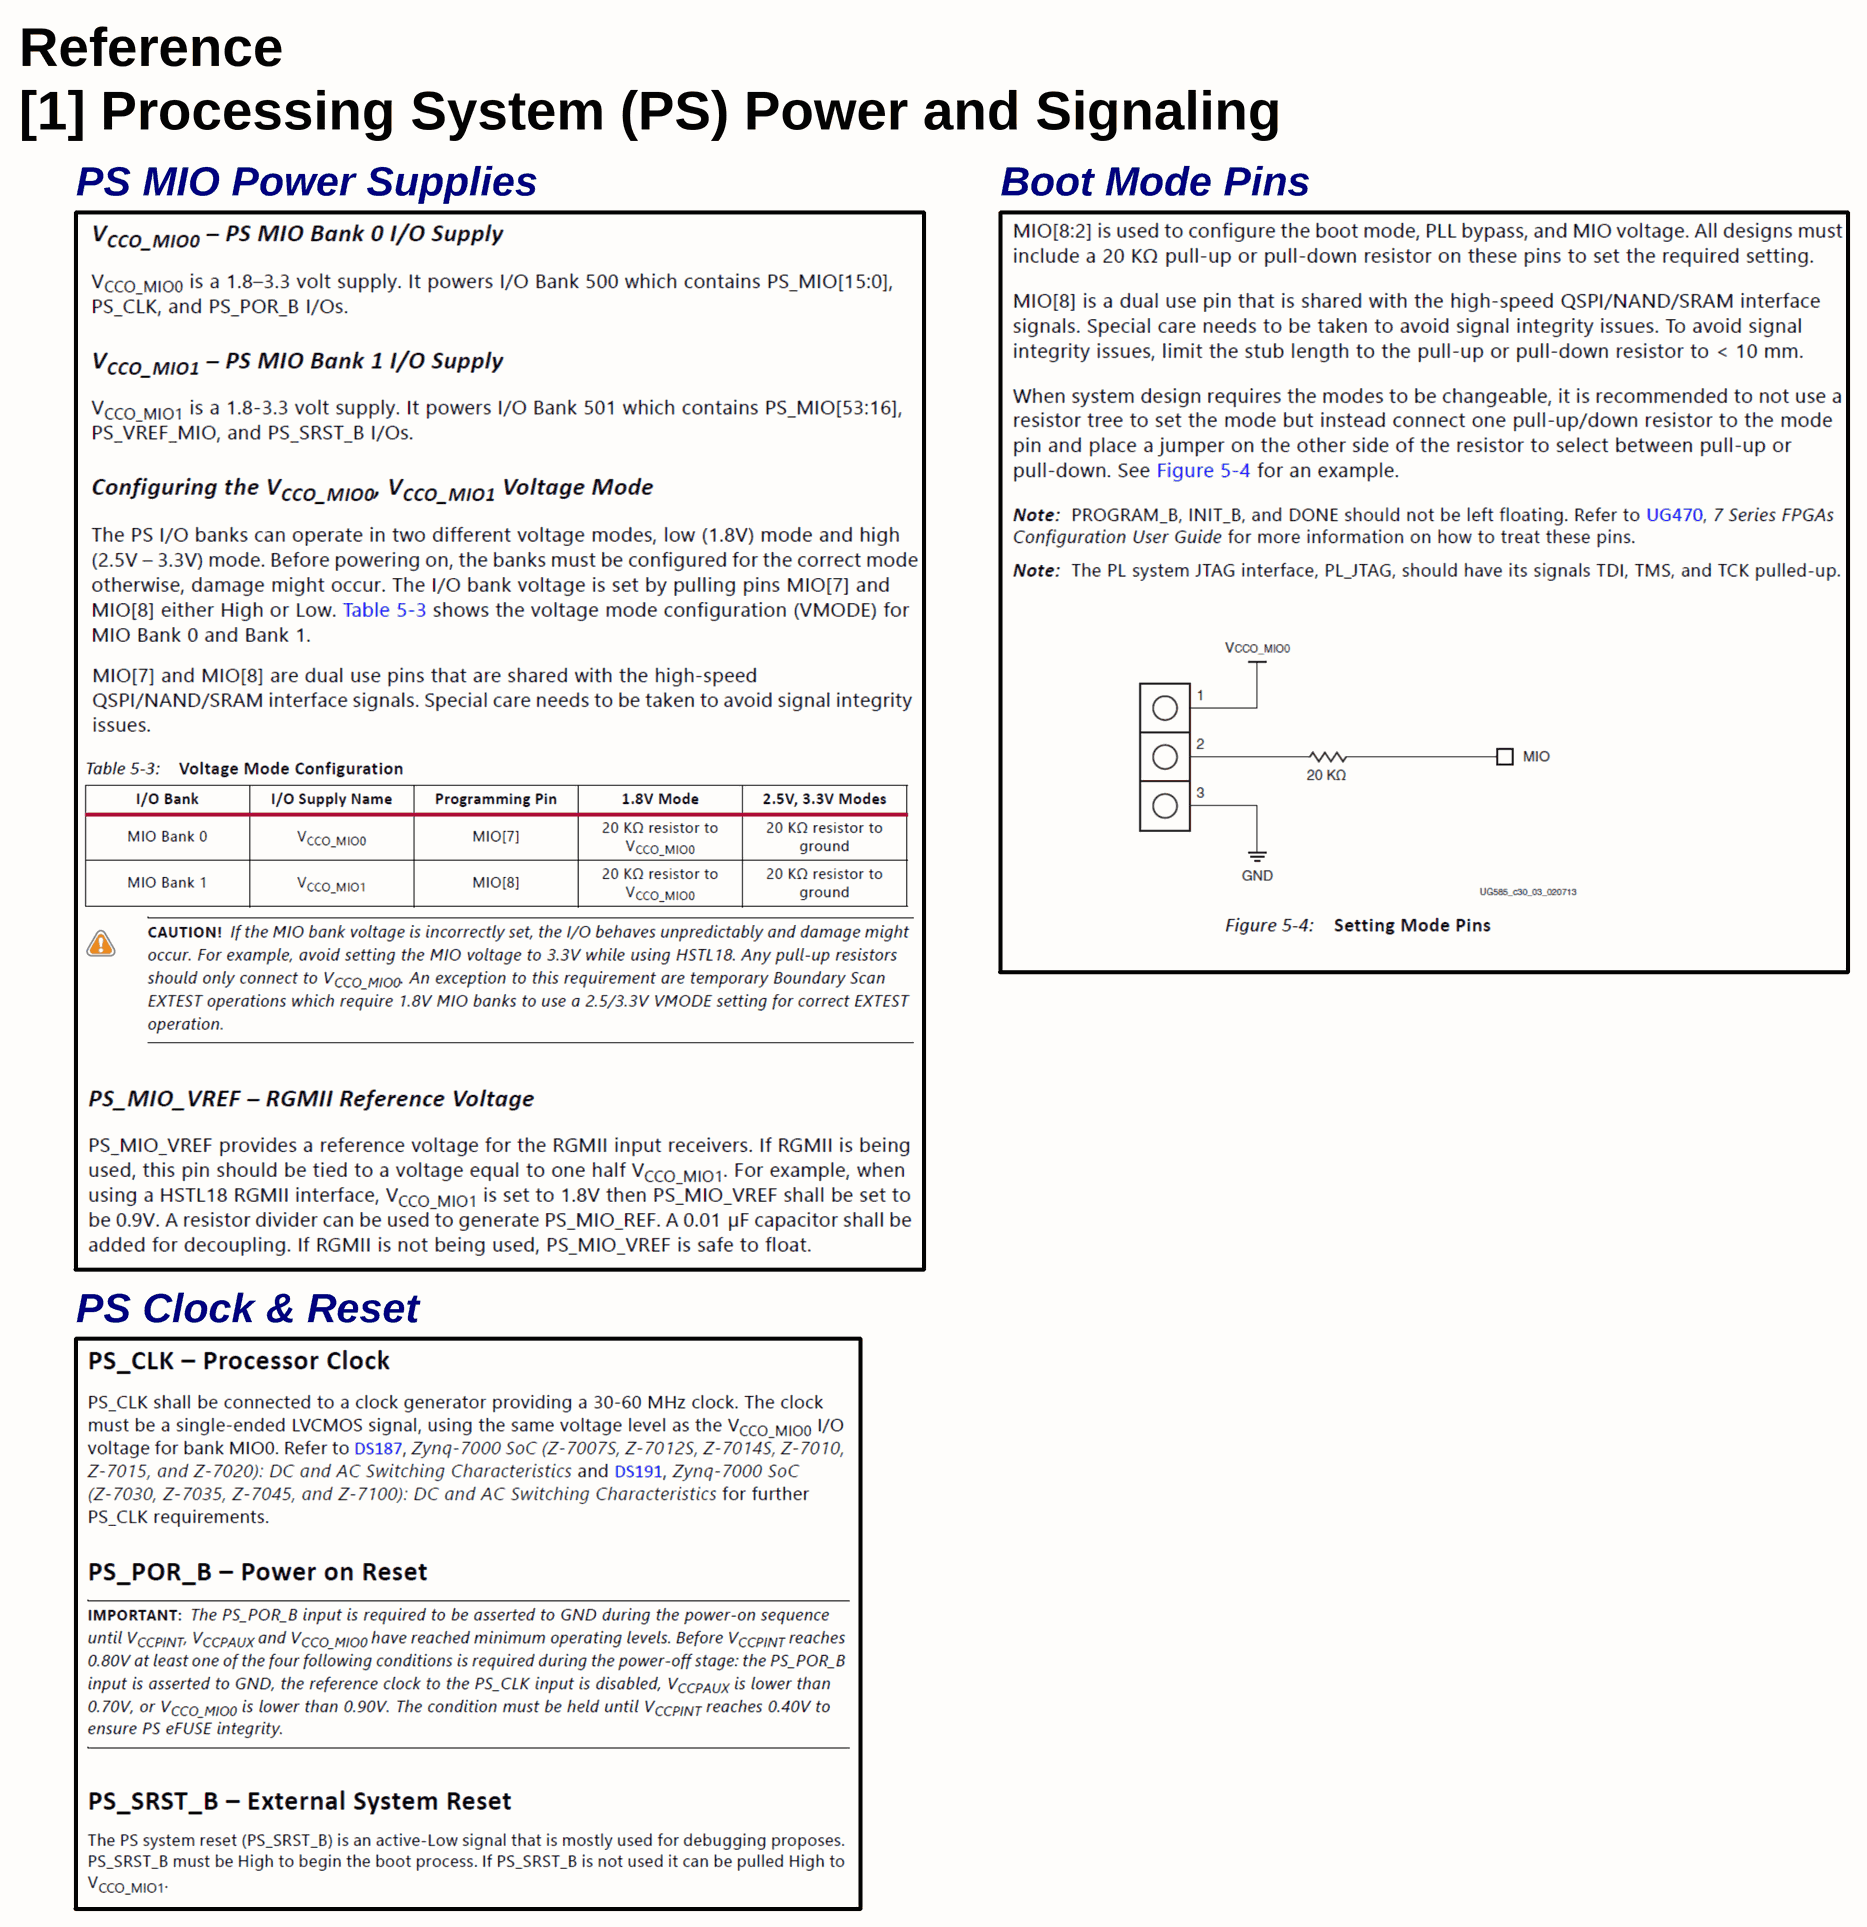
[diagram p10: Ref.01_Zynq_Power_Config_2.SchDoc]

### Notes on the sheet
- Reference
- [1] Processing System (PS) Power and Signaling
- PS MIO Power Supplies
- Boot Mode Pins
- PS Clock & Reset
- Title
- Rev
- Doc
- Sheet #
- of
- Author
- This document is copyright of ArkX and shall not be revealed, produced, copied, in whole or in part,
- Date
- nor used for any purpose other than submitted.

## Sheet Ref.02_DDR_Memory_1.SchDoc
size A2; SheetNumber: 10; SheetTotal: 11
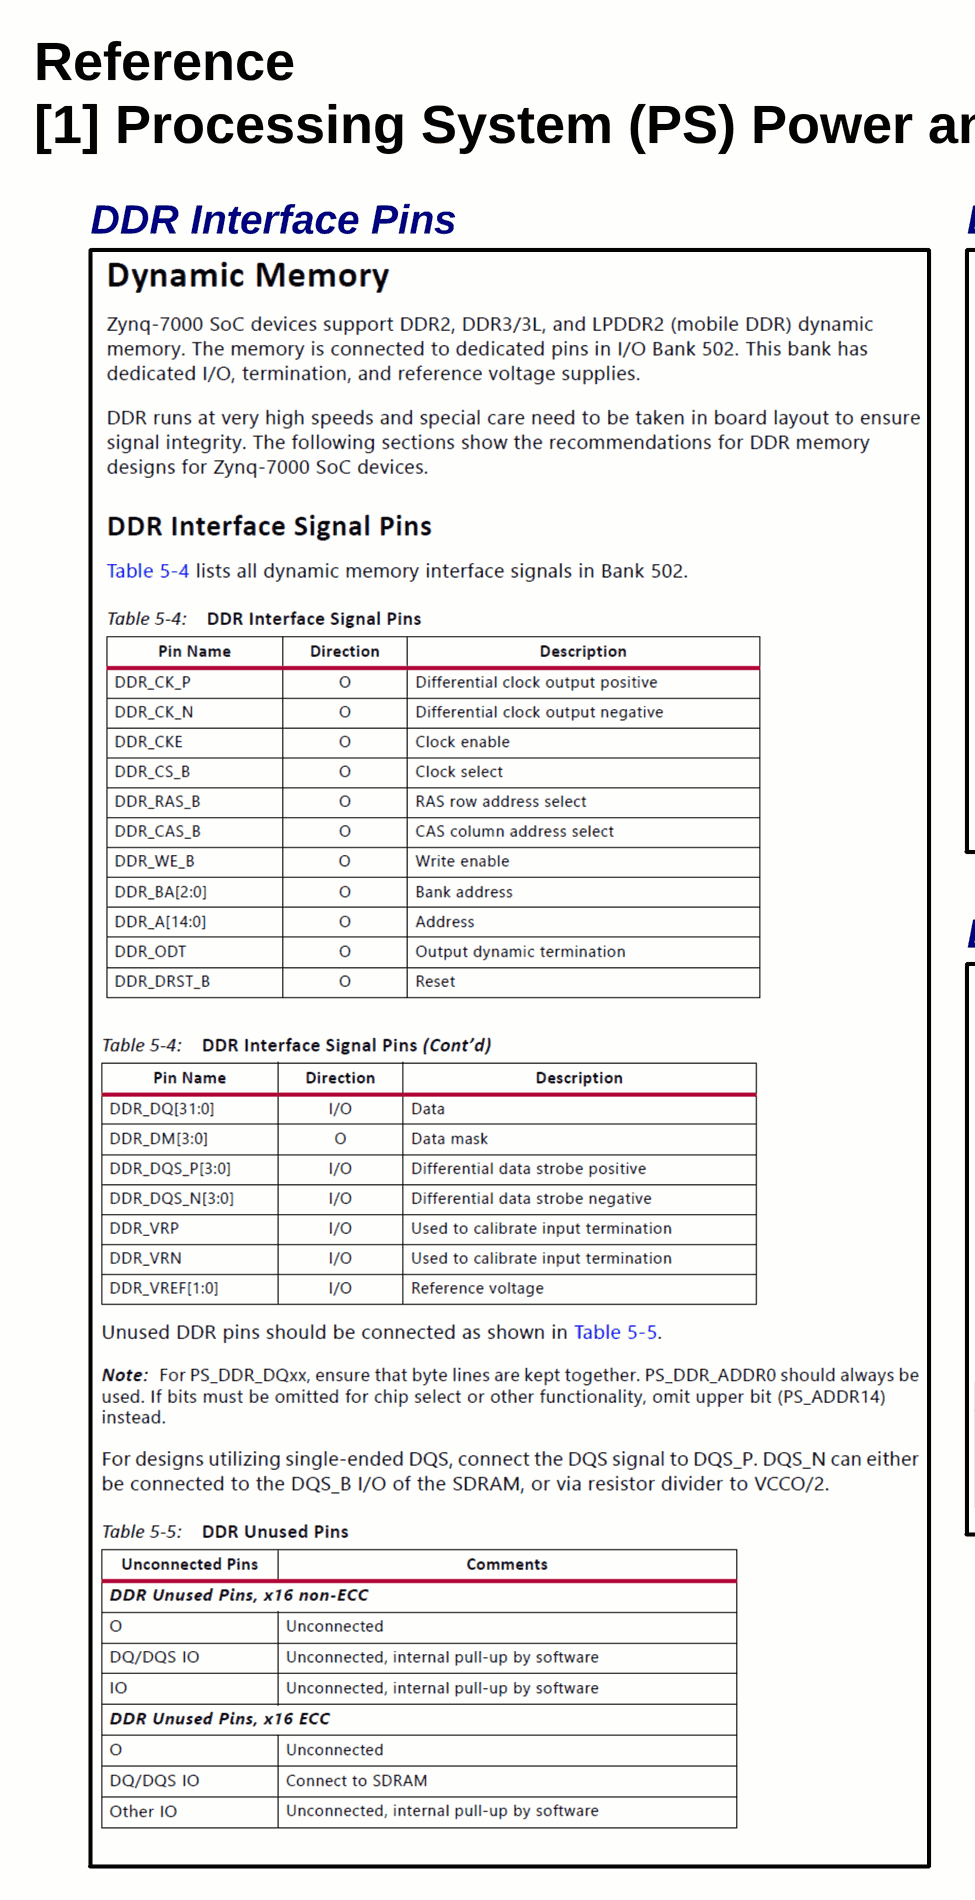
[diagram p11: Ref.02_DDR_Memory_1.SchDoc, left]
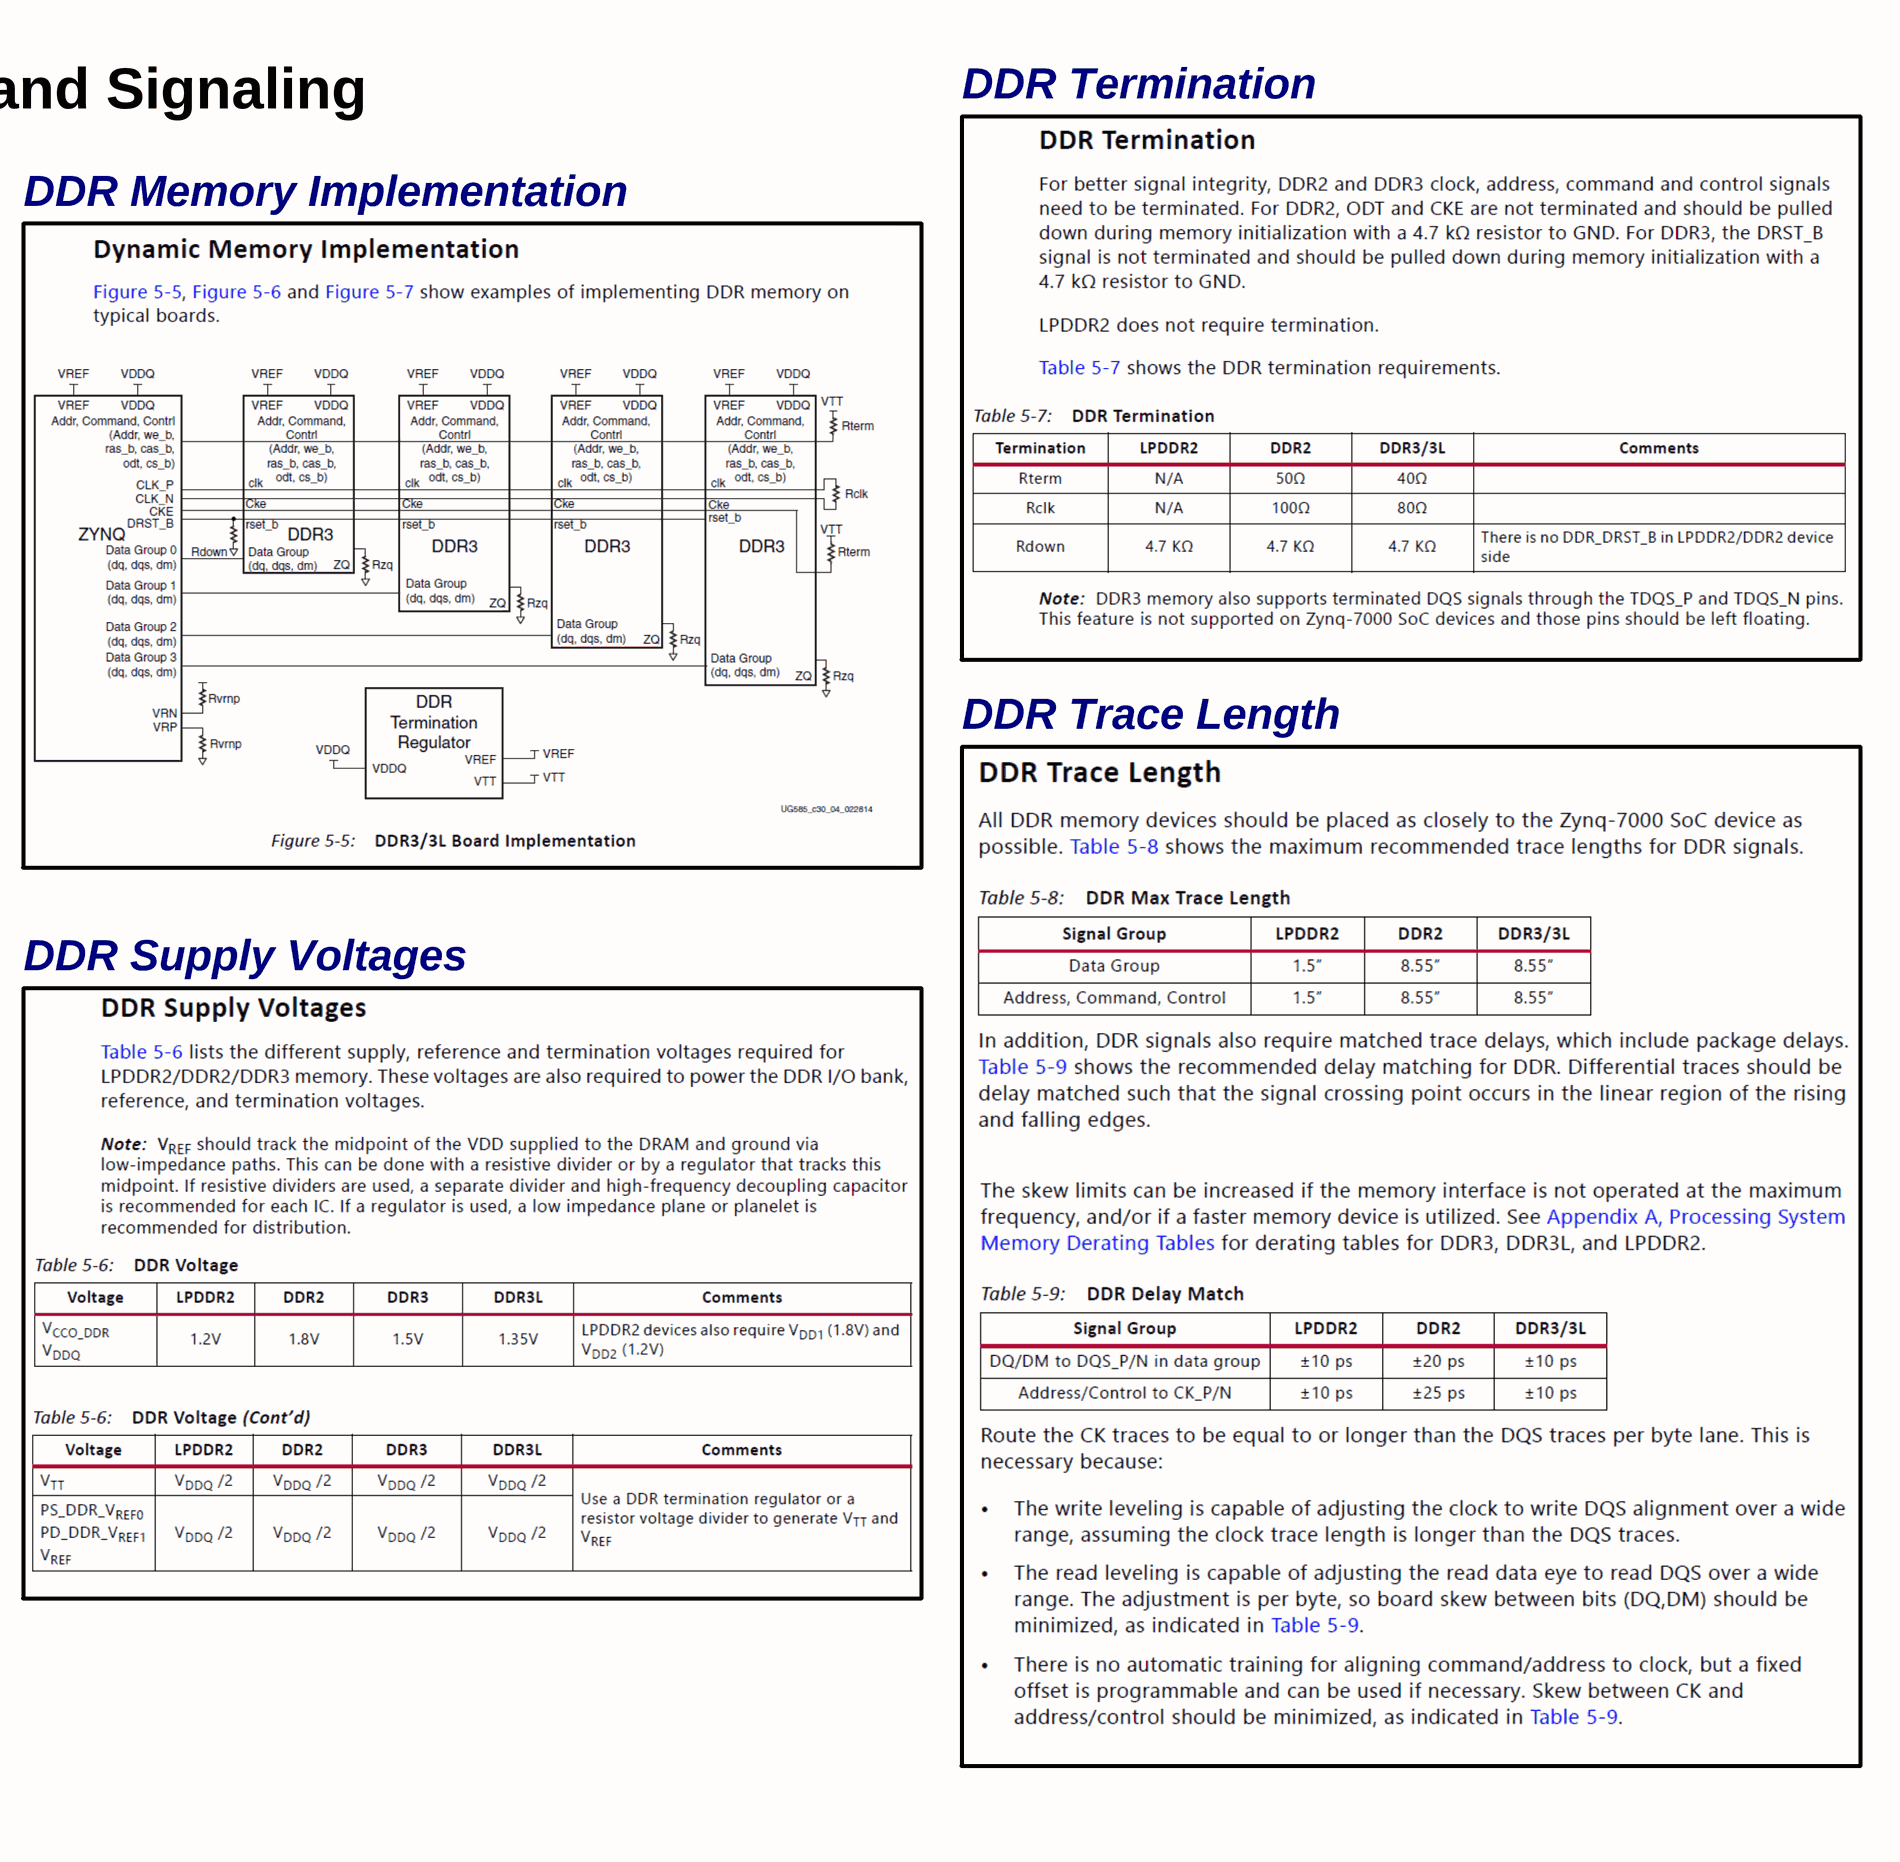
[diagram p12: Ref.02_DDR_Memory_1.SchDoc, right]

### Notes on the sheet
- Reference
- DDR Termination
- [1] Processing System (PS) Power and Signaling
- DDR Interface Pins
- DDR Memory Implementation
- DDR Trace Length
- DDR Supply Voltages
- Title
- Rev
- Doc
- Sheet #
- of
- Author
- This document is copyright of ArkX and shall not be revealed, produced, copied, in whole or in part,
- Date
- nor used for any purpose other than submitted.

## Sheet Ref.03_DDR_Memory_2.SchDoc
size A2; SheetNumber: 11; SheetTotal: 11
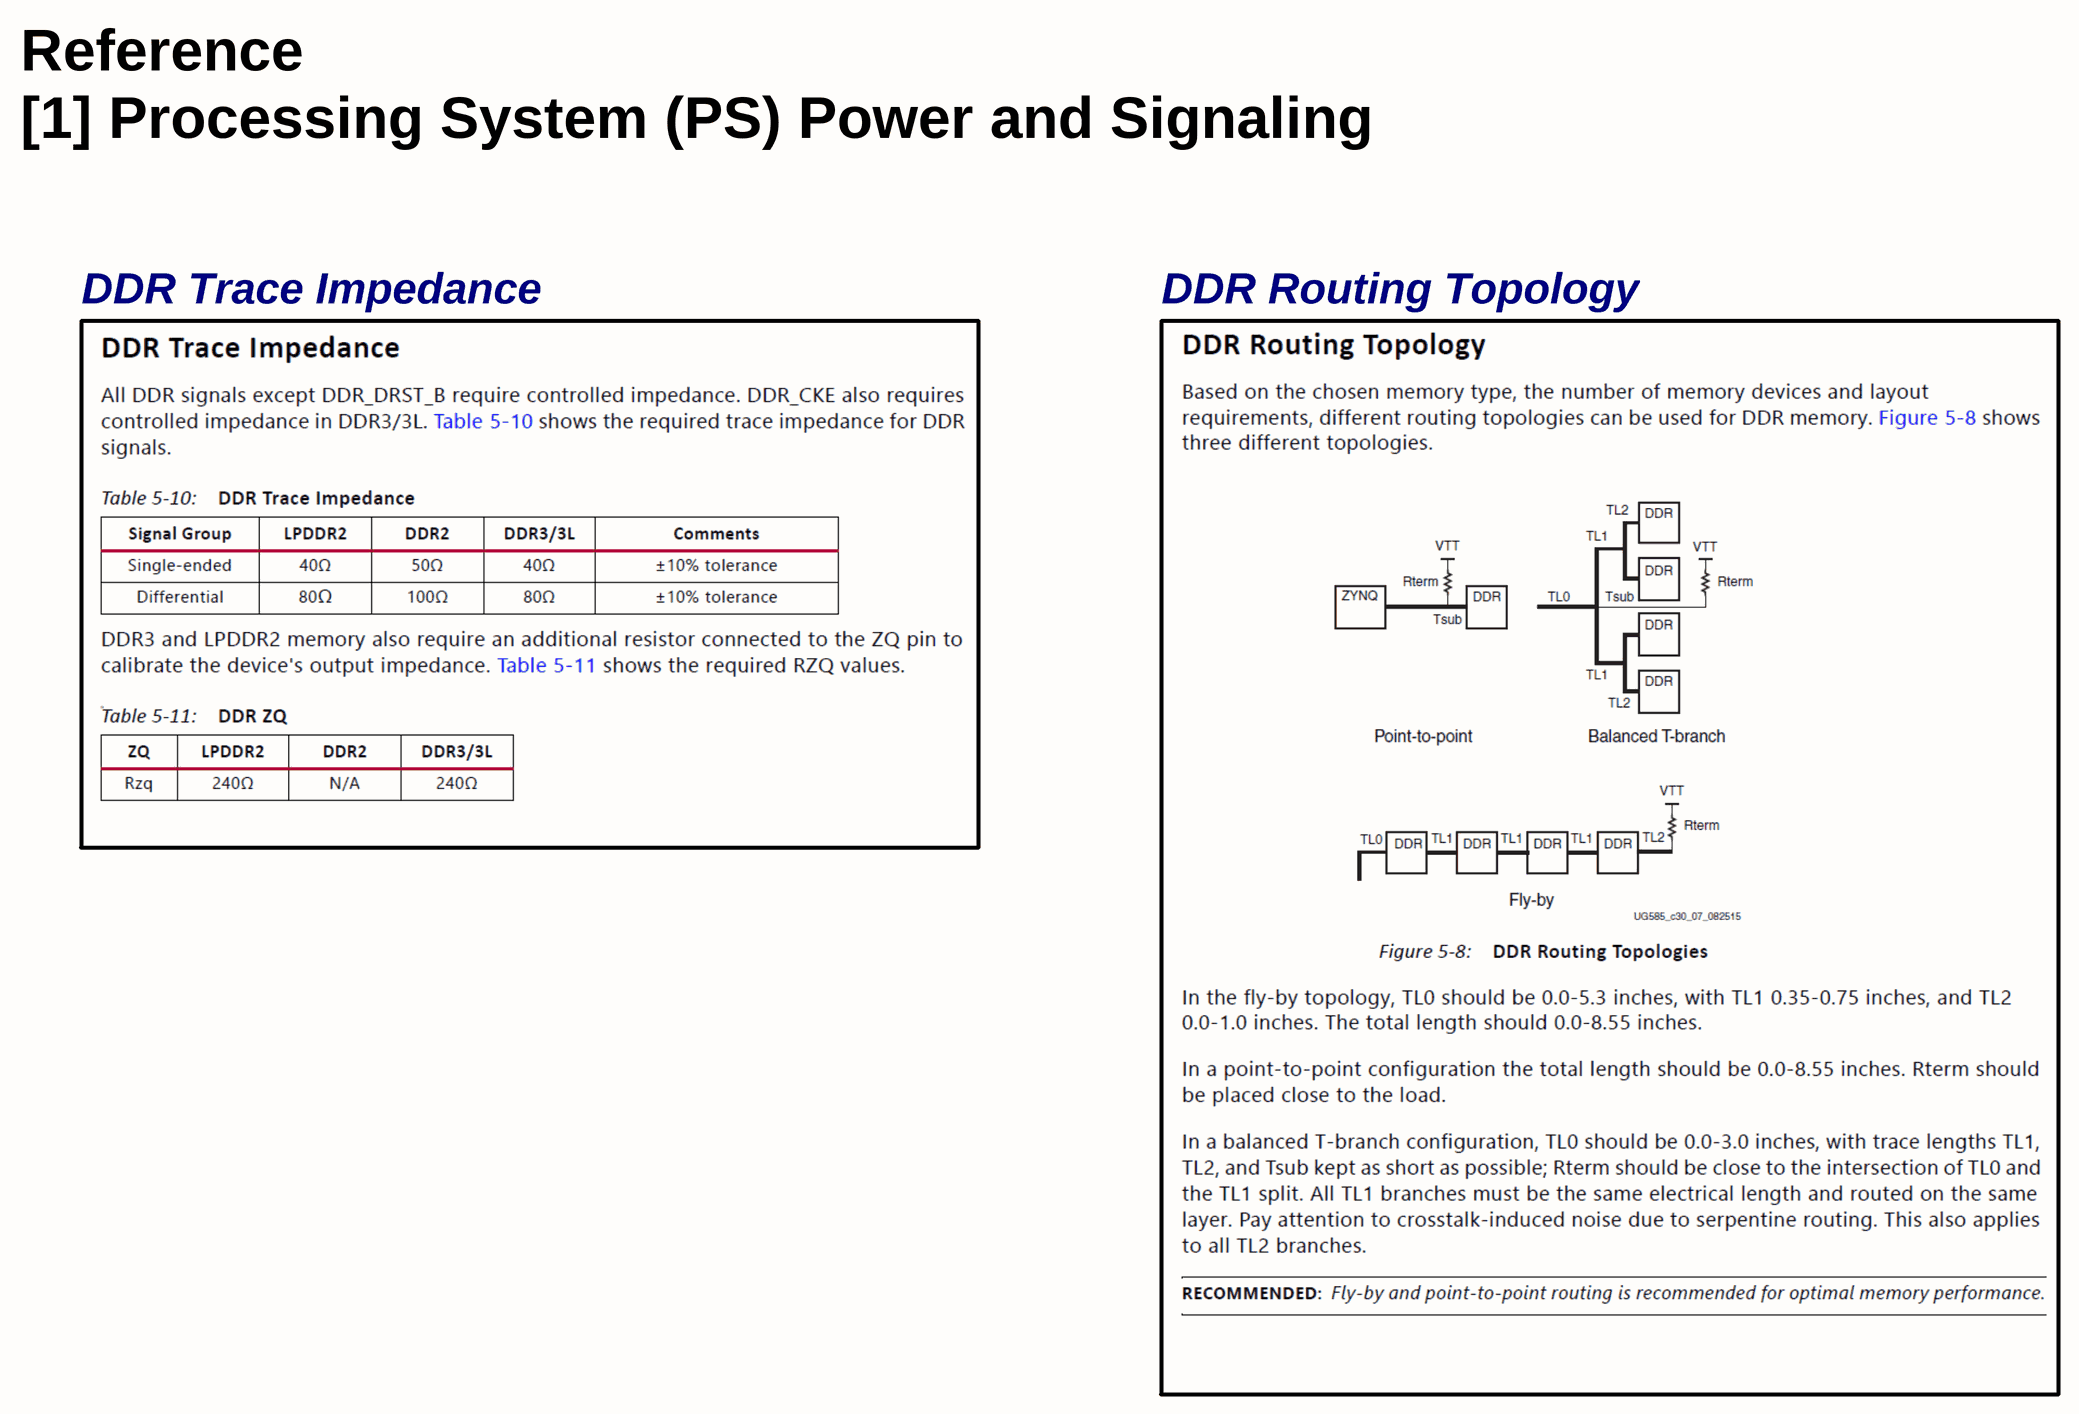
[diagram p13: Ref.03_DDR_Memory_2.SchDoc]

### Notes on the sheet
- Reference
- [1] Processing System (PS) Power and Signaling
- DDR Trace Impedance
- DDR Routing Topology
- Title
- Rev
- Doc
- Sheet #
- of
- Author
- This document is copyright of ArkX and shall not be revealed, produced, copied, in whole or in part,
- Date
- nor used for any purpose other than submitted.

## Nets that join several sheets
+1.8V: 03_Power (5 pins), 04_Zynq_Power (22 pins)
+1.35V: 03_Power (6 pins), 04_Zynq_Power (16 pins)
+1V: 03_Power (5 pins), 04_Zynq_Power (29 pins)
+3.3V: 03_Power (5 pins), 04_Zynq_Power (47 pins), 05_Zynq_Config (36 pins), 06_Zynq_PS (13 pins)
+VCC: 03_Power (7 pins), 05_Zynq_Config (D?#2.2)
GND: 03_Power (54 pins), 04_Zynq_Power (110 pins), 05_Zynq_Config (59 pins), 06_Zynq_PS (14 pins)
FLASH_CLK_M4: 05_Zynq_Config (R?#59.2), 06_Zynq_PS (R?#74.2 U?#15.6)
PG_3V3: 03_Power (5 pins), 06_Zynq_PS (U?#16.2)
PS_NPOR: 05_Zynq_Config (R?#43.2), 06_Zynq_PS (C?#104.2 R?#77.1 U?#14.C7 U?#16.4)
UART0_RX: 05_Zynq_Config (R?#49.2), 06_Zynq_PS (U?#14.E9)
UART0_TX: 05_Zynq_Config (R?#50.2), 06_Zynq_PS (U?#14.C6)